# Altium project 底板.PrjPcb
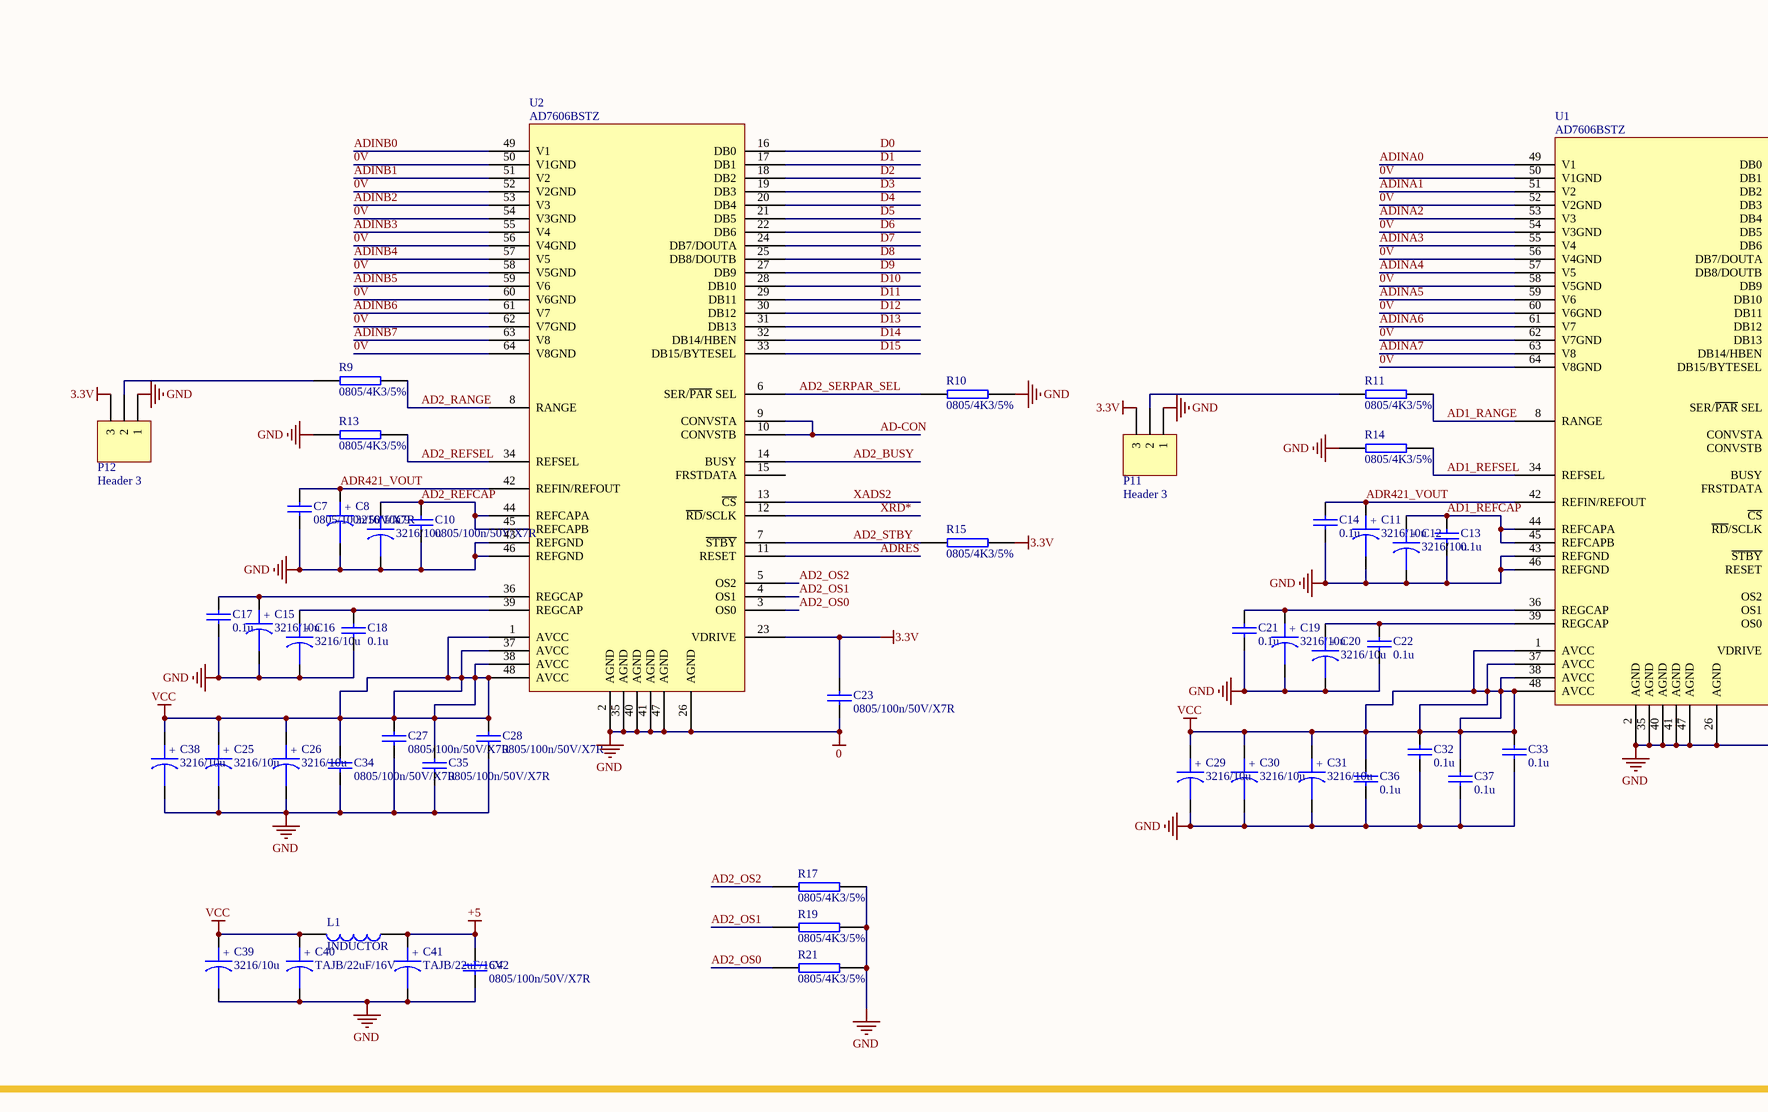
[diagram p0: 底板原理图.SchDoc, top left]
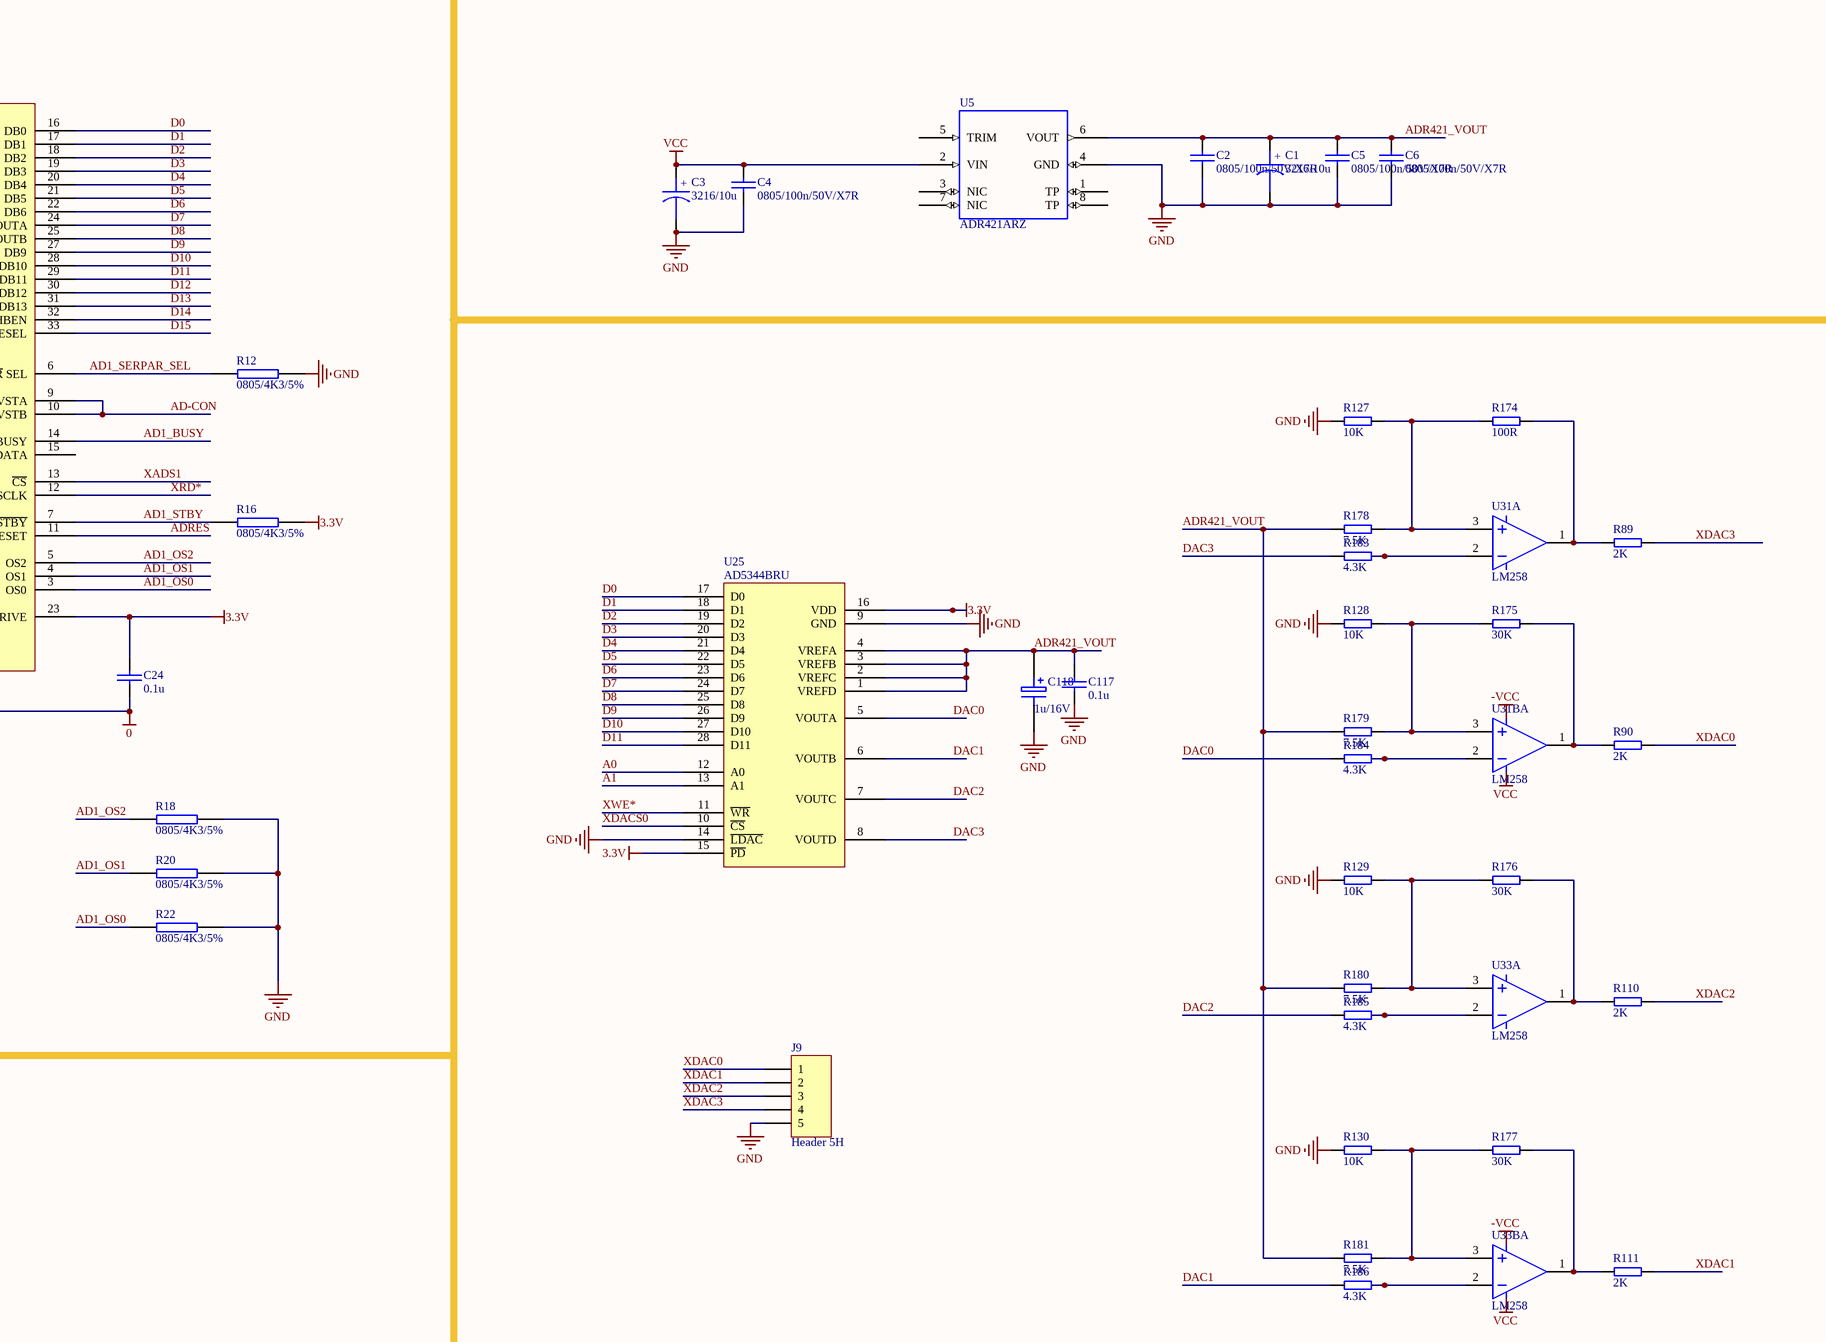
[diagram p1: 底板原理图.SchDoc, top middle]
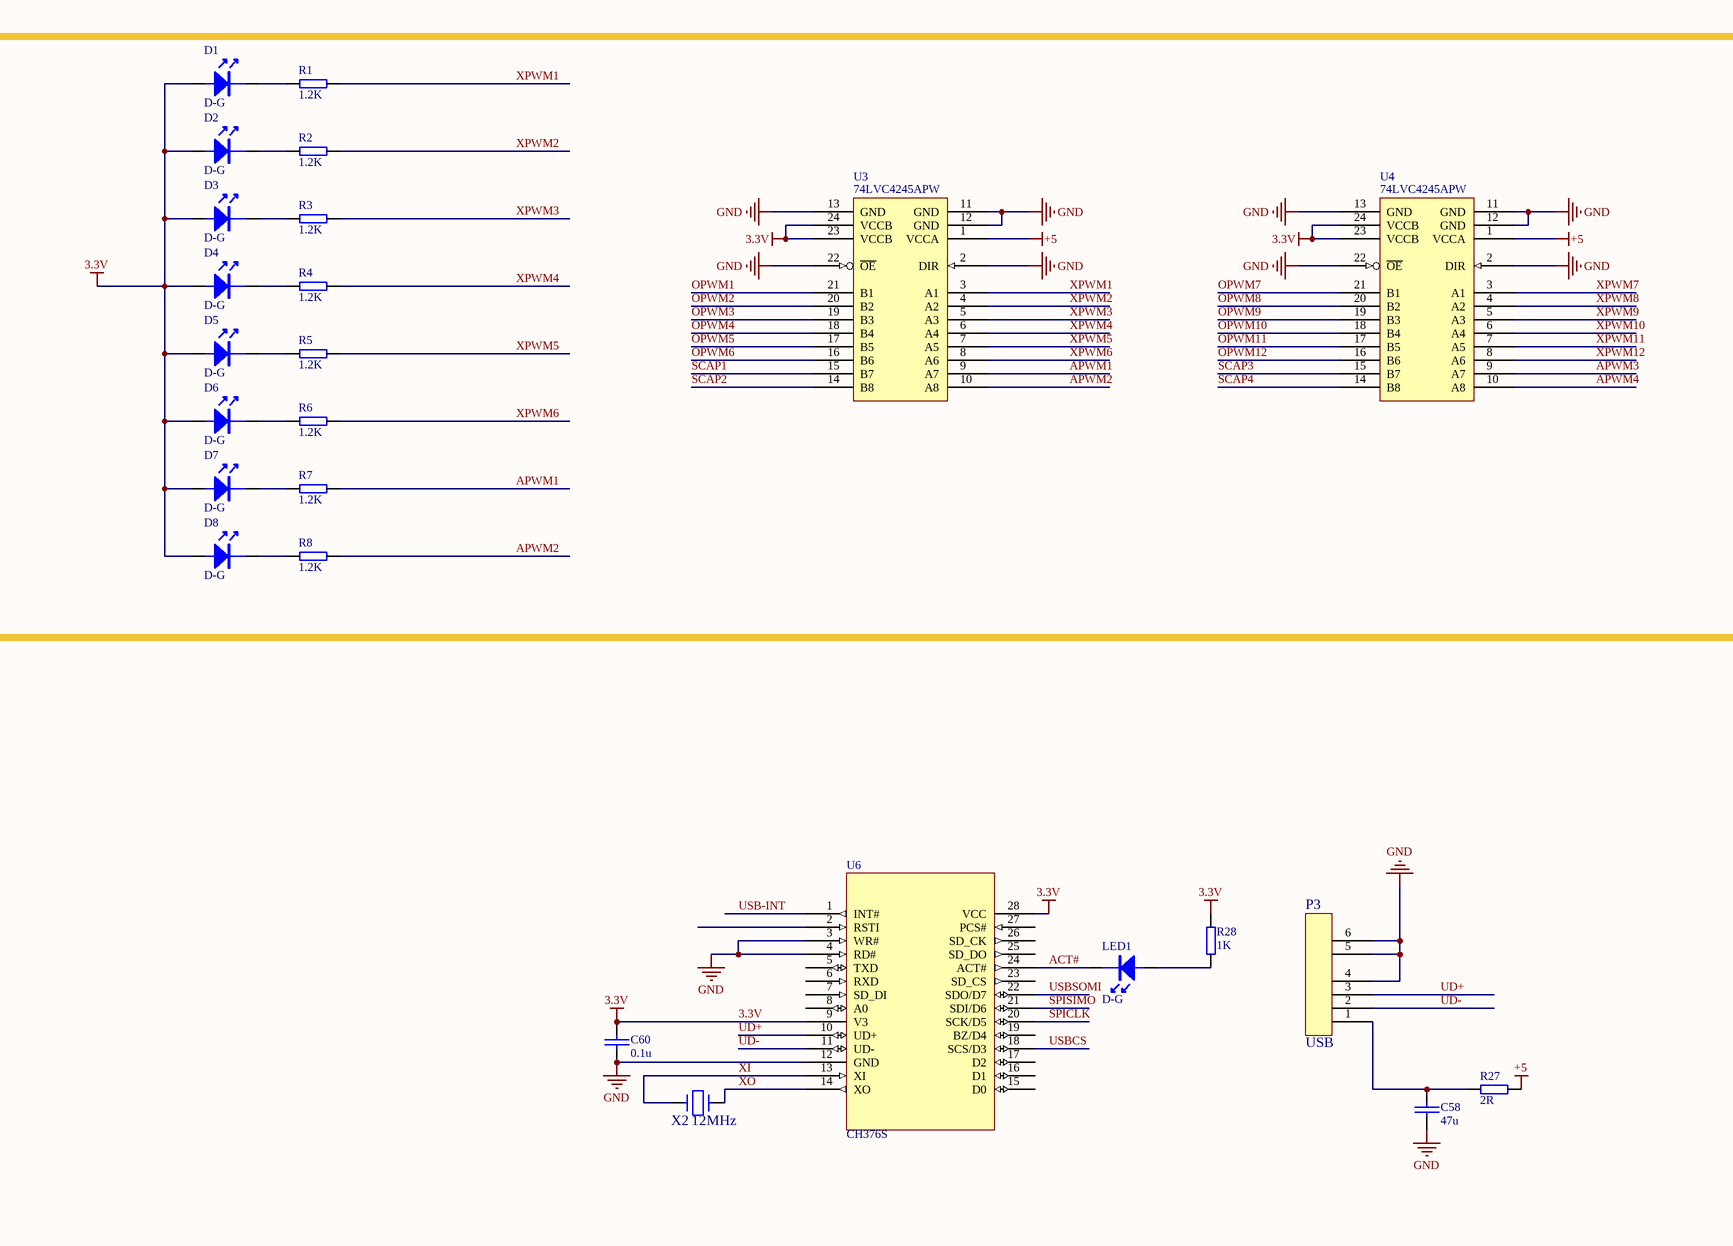
[diagram p2: 底板原理图.SchDoc, top right]
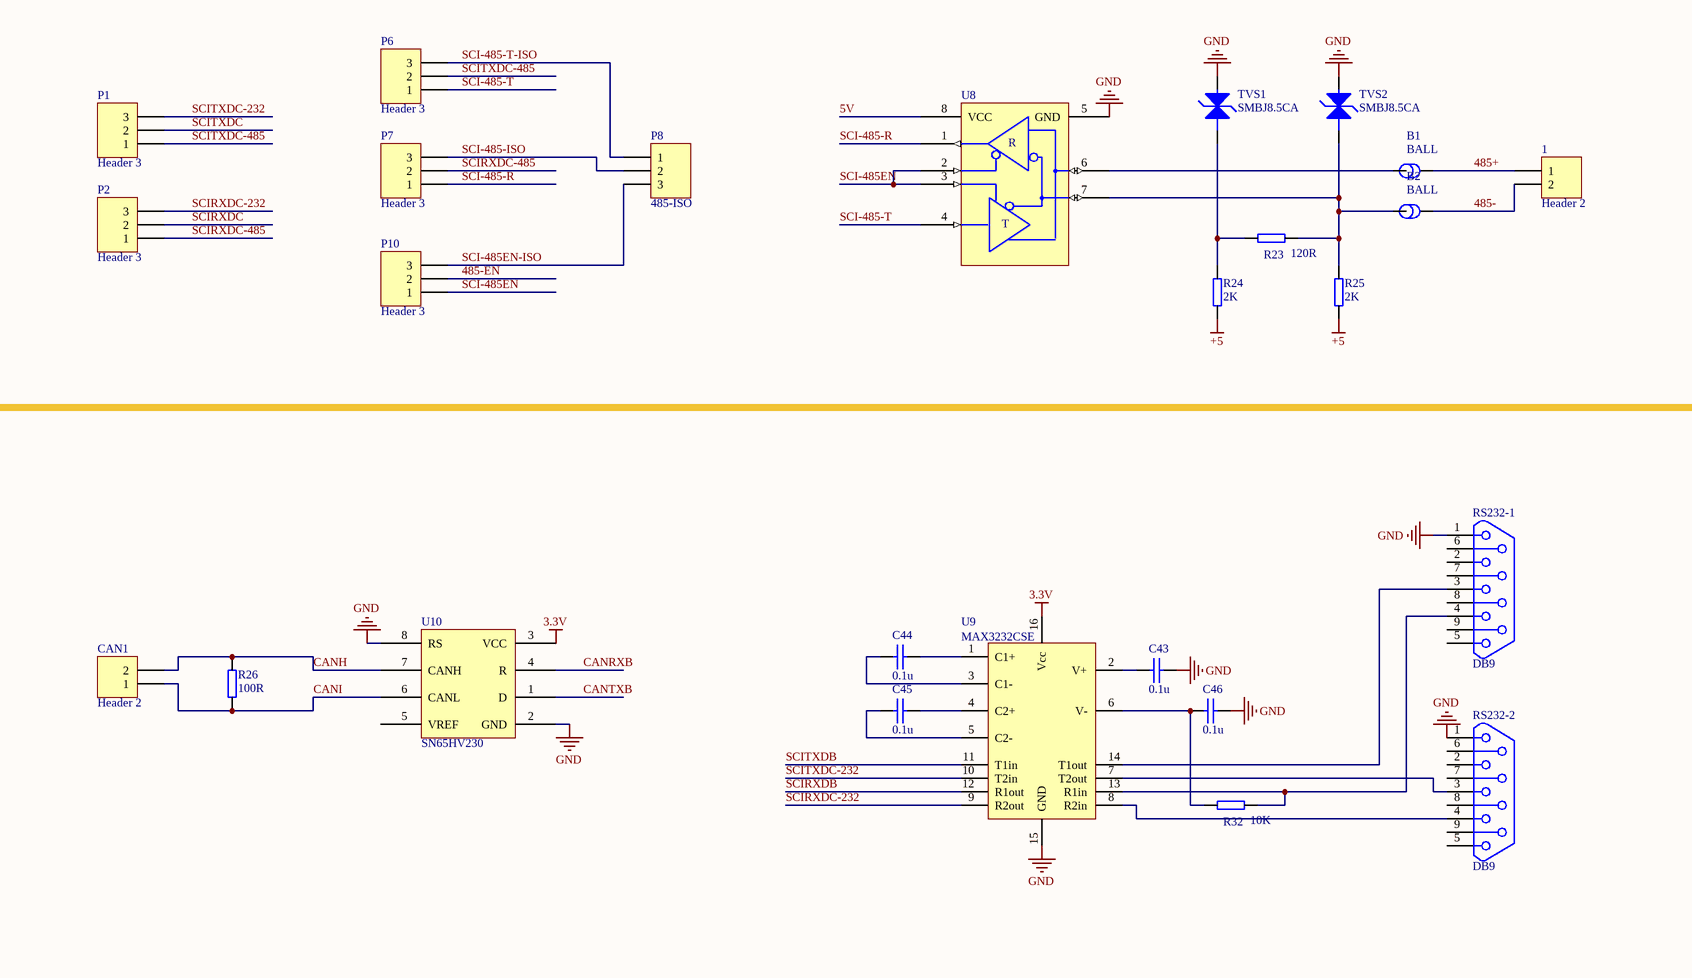
[diagram p3: 底板原理图.SchDoc, centre left]
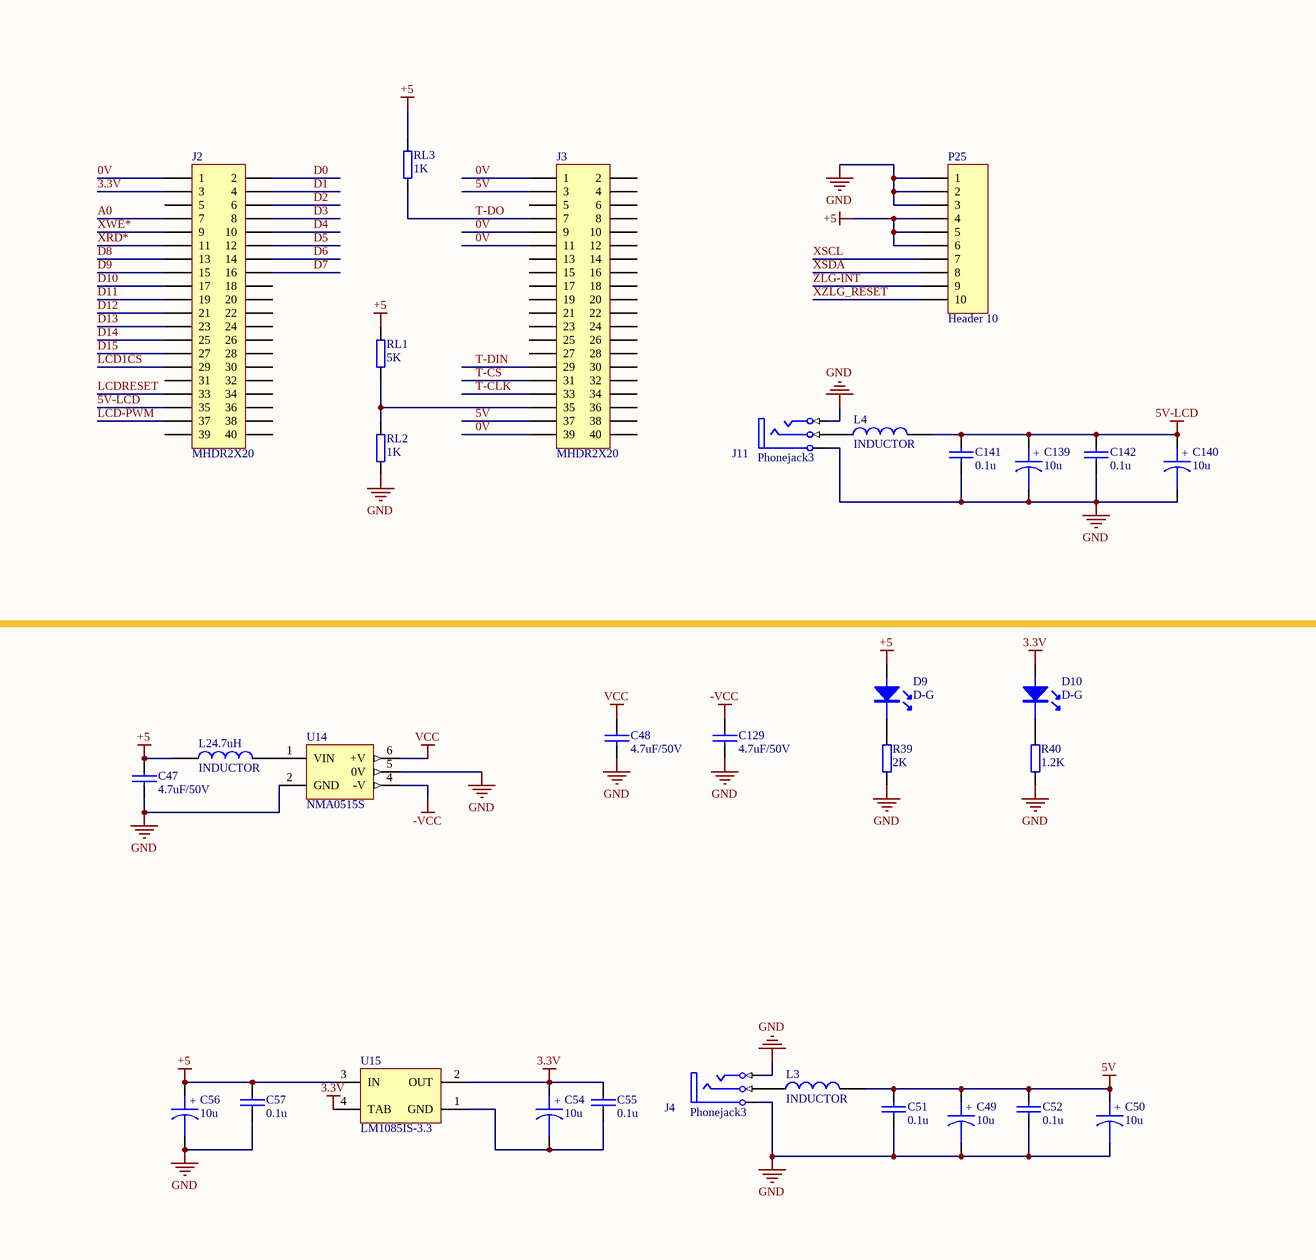
[diagram p4: 底板原理图.SchDoc, centre middle]
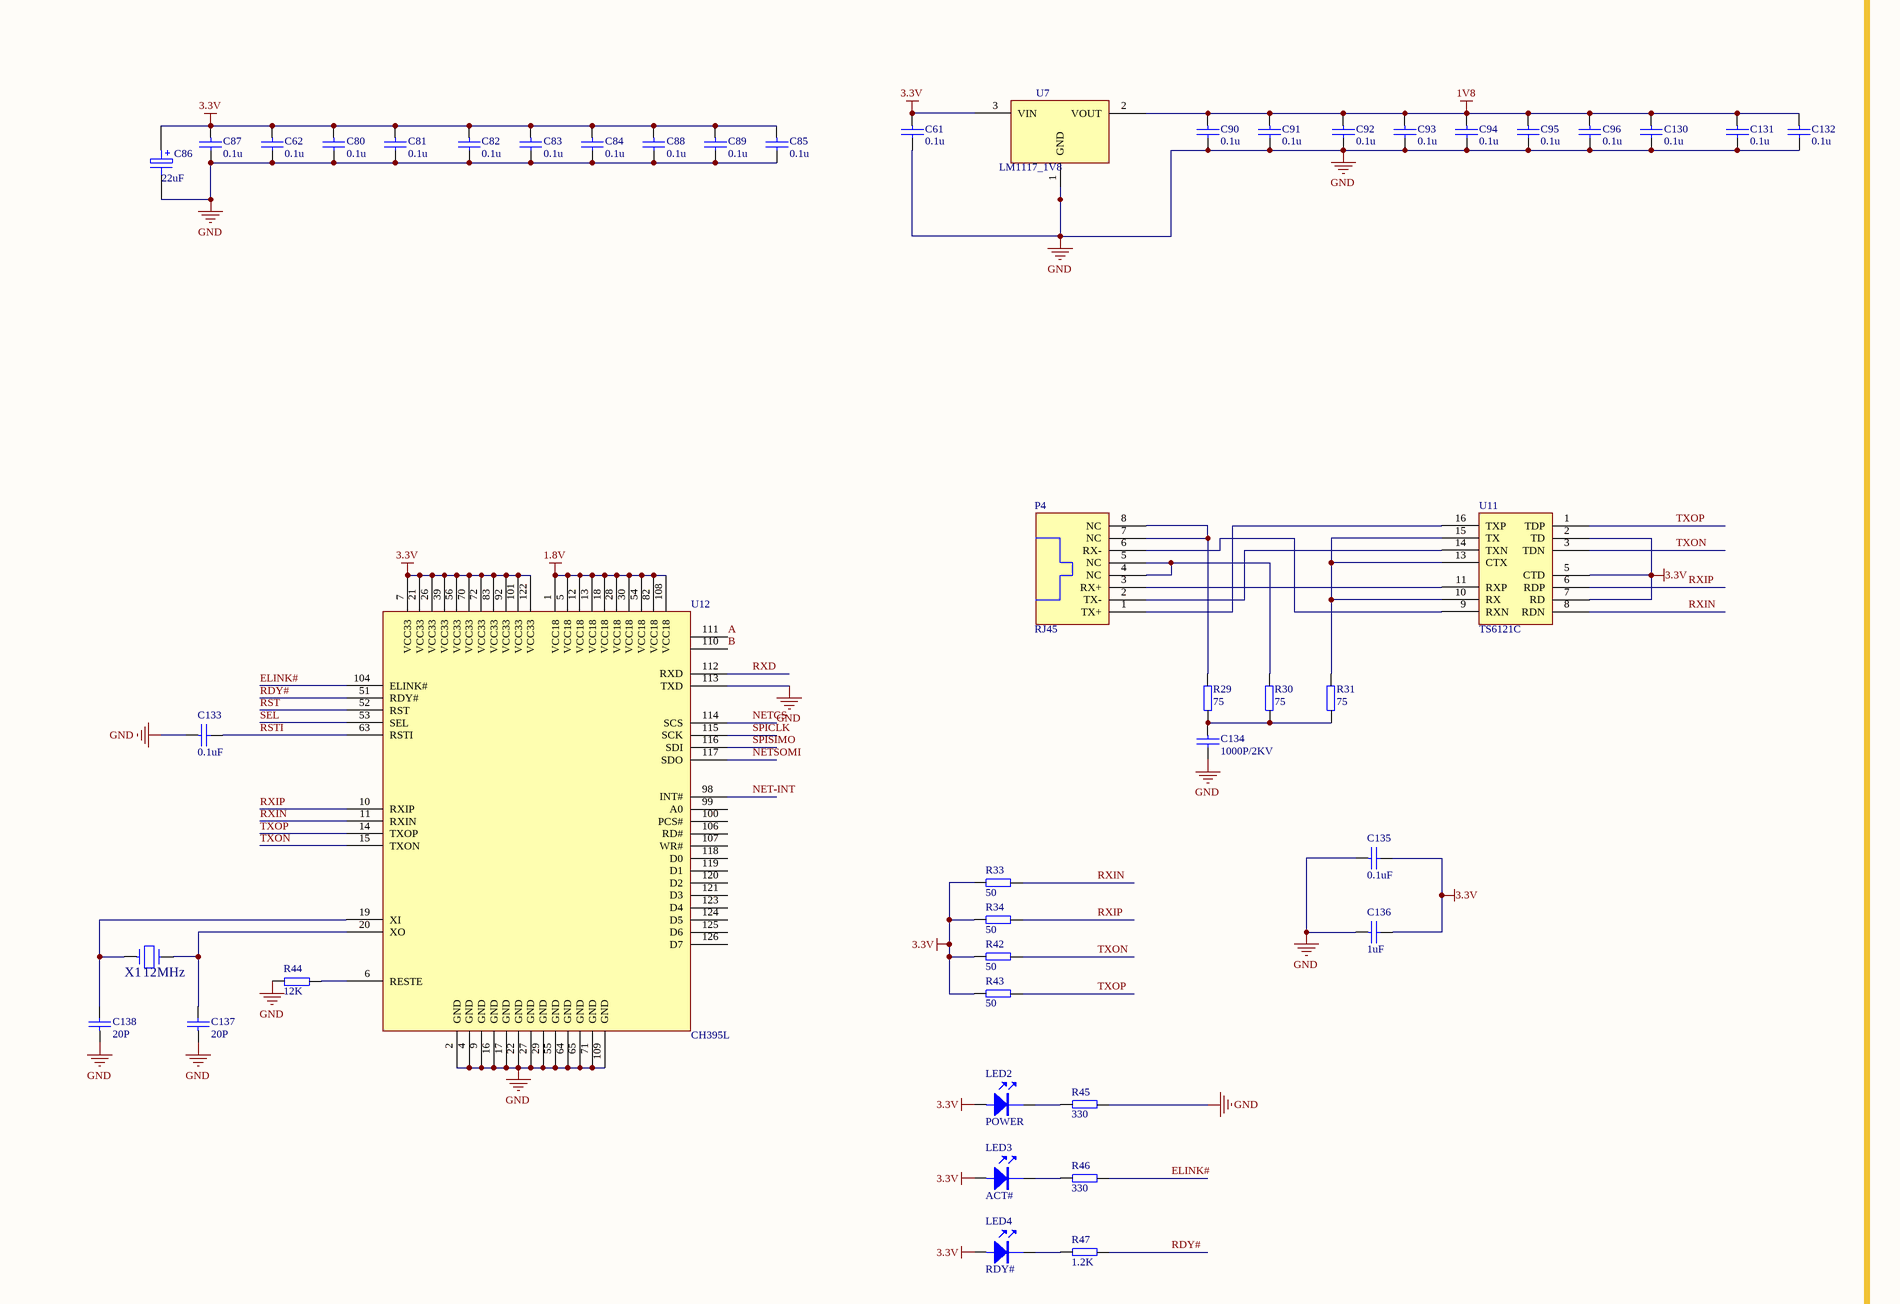
[diagram p5: 底板原理图.SchDoc, centre right]
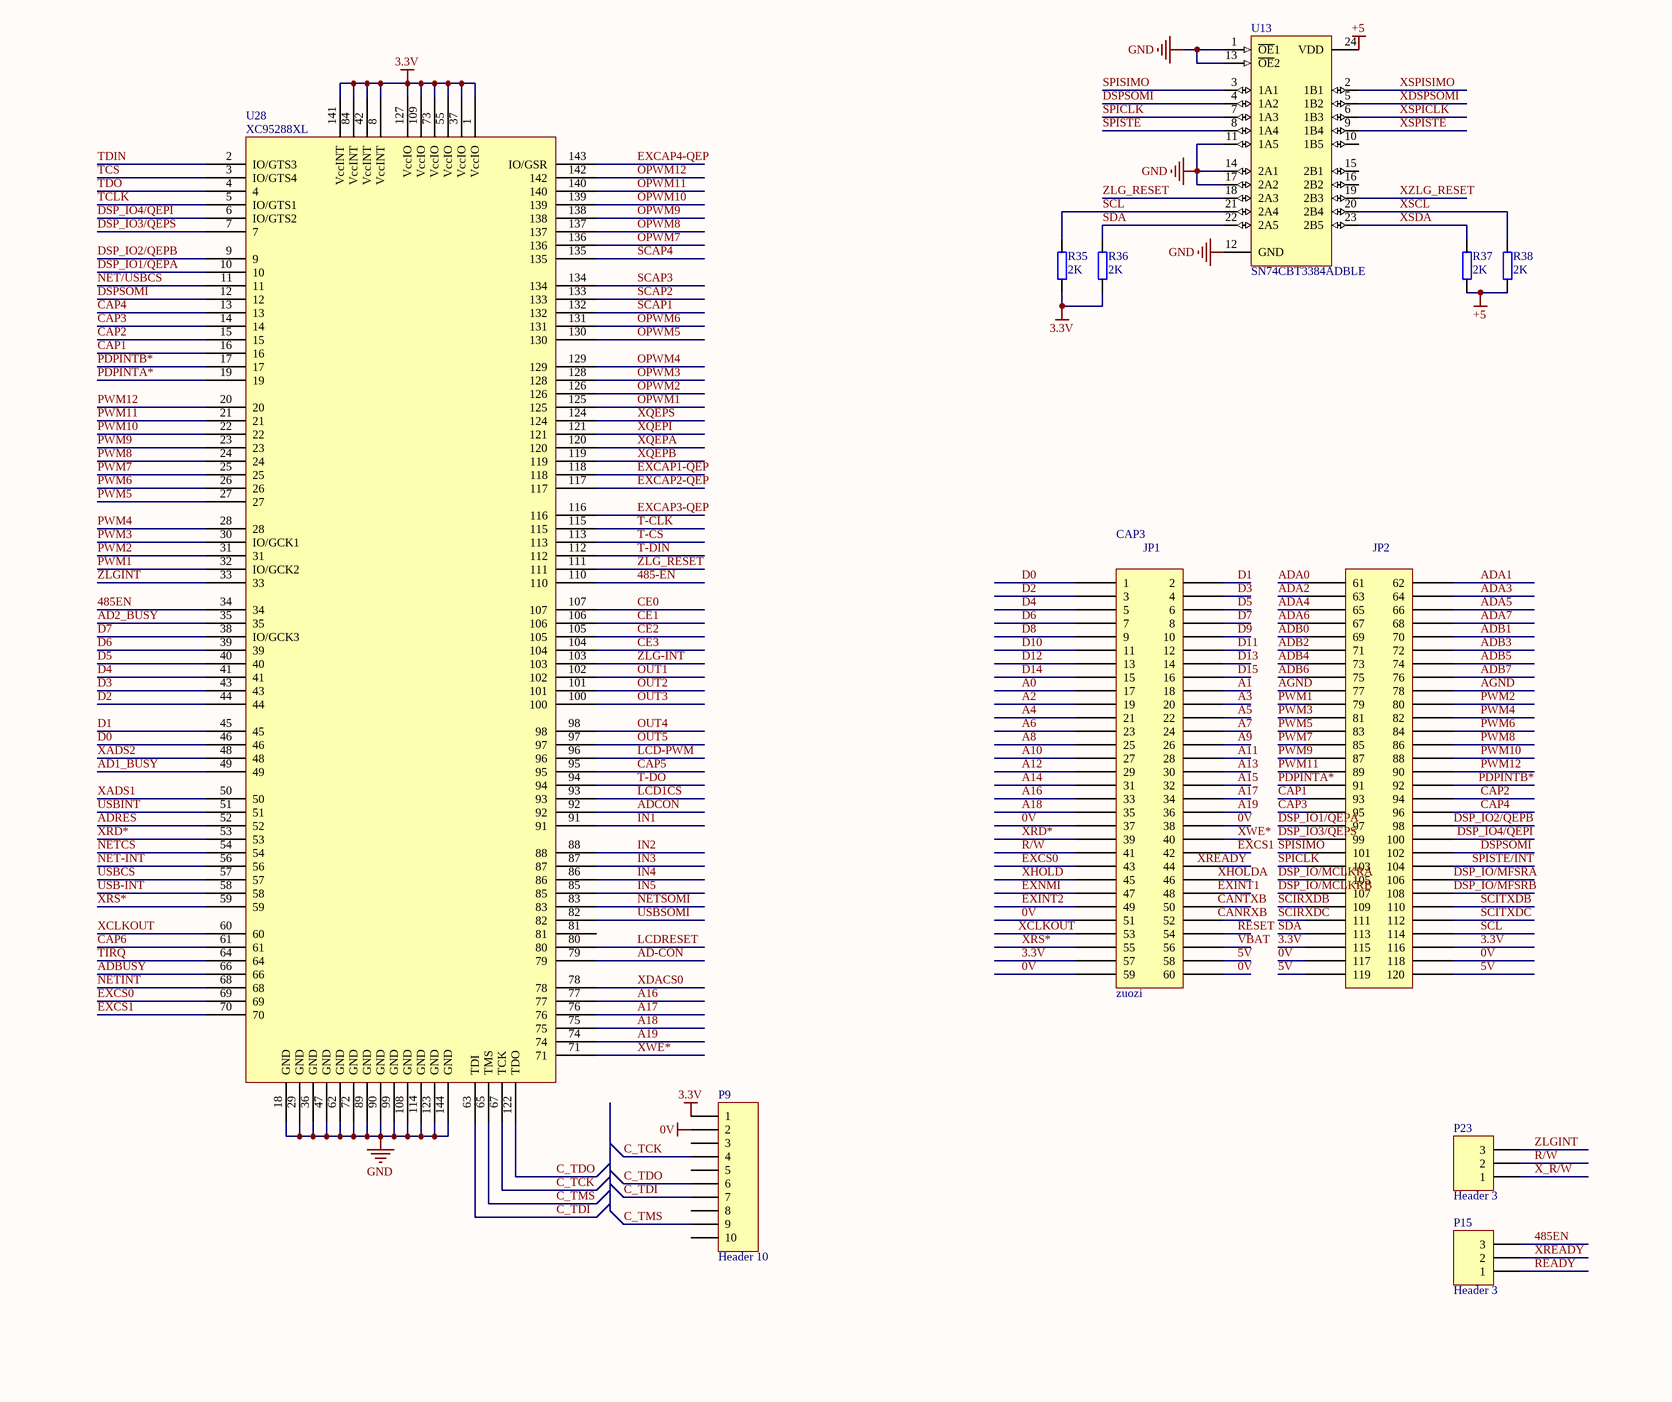
[diagram p6: 底板原理图.SchDoc, bottom left]
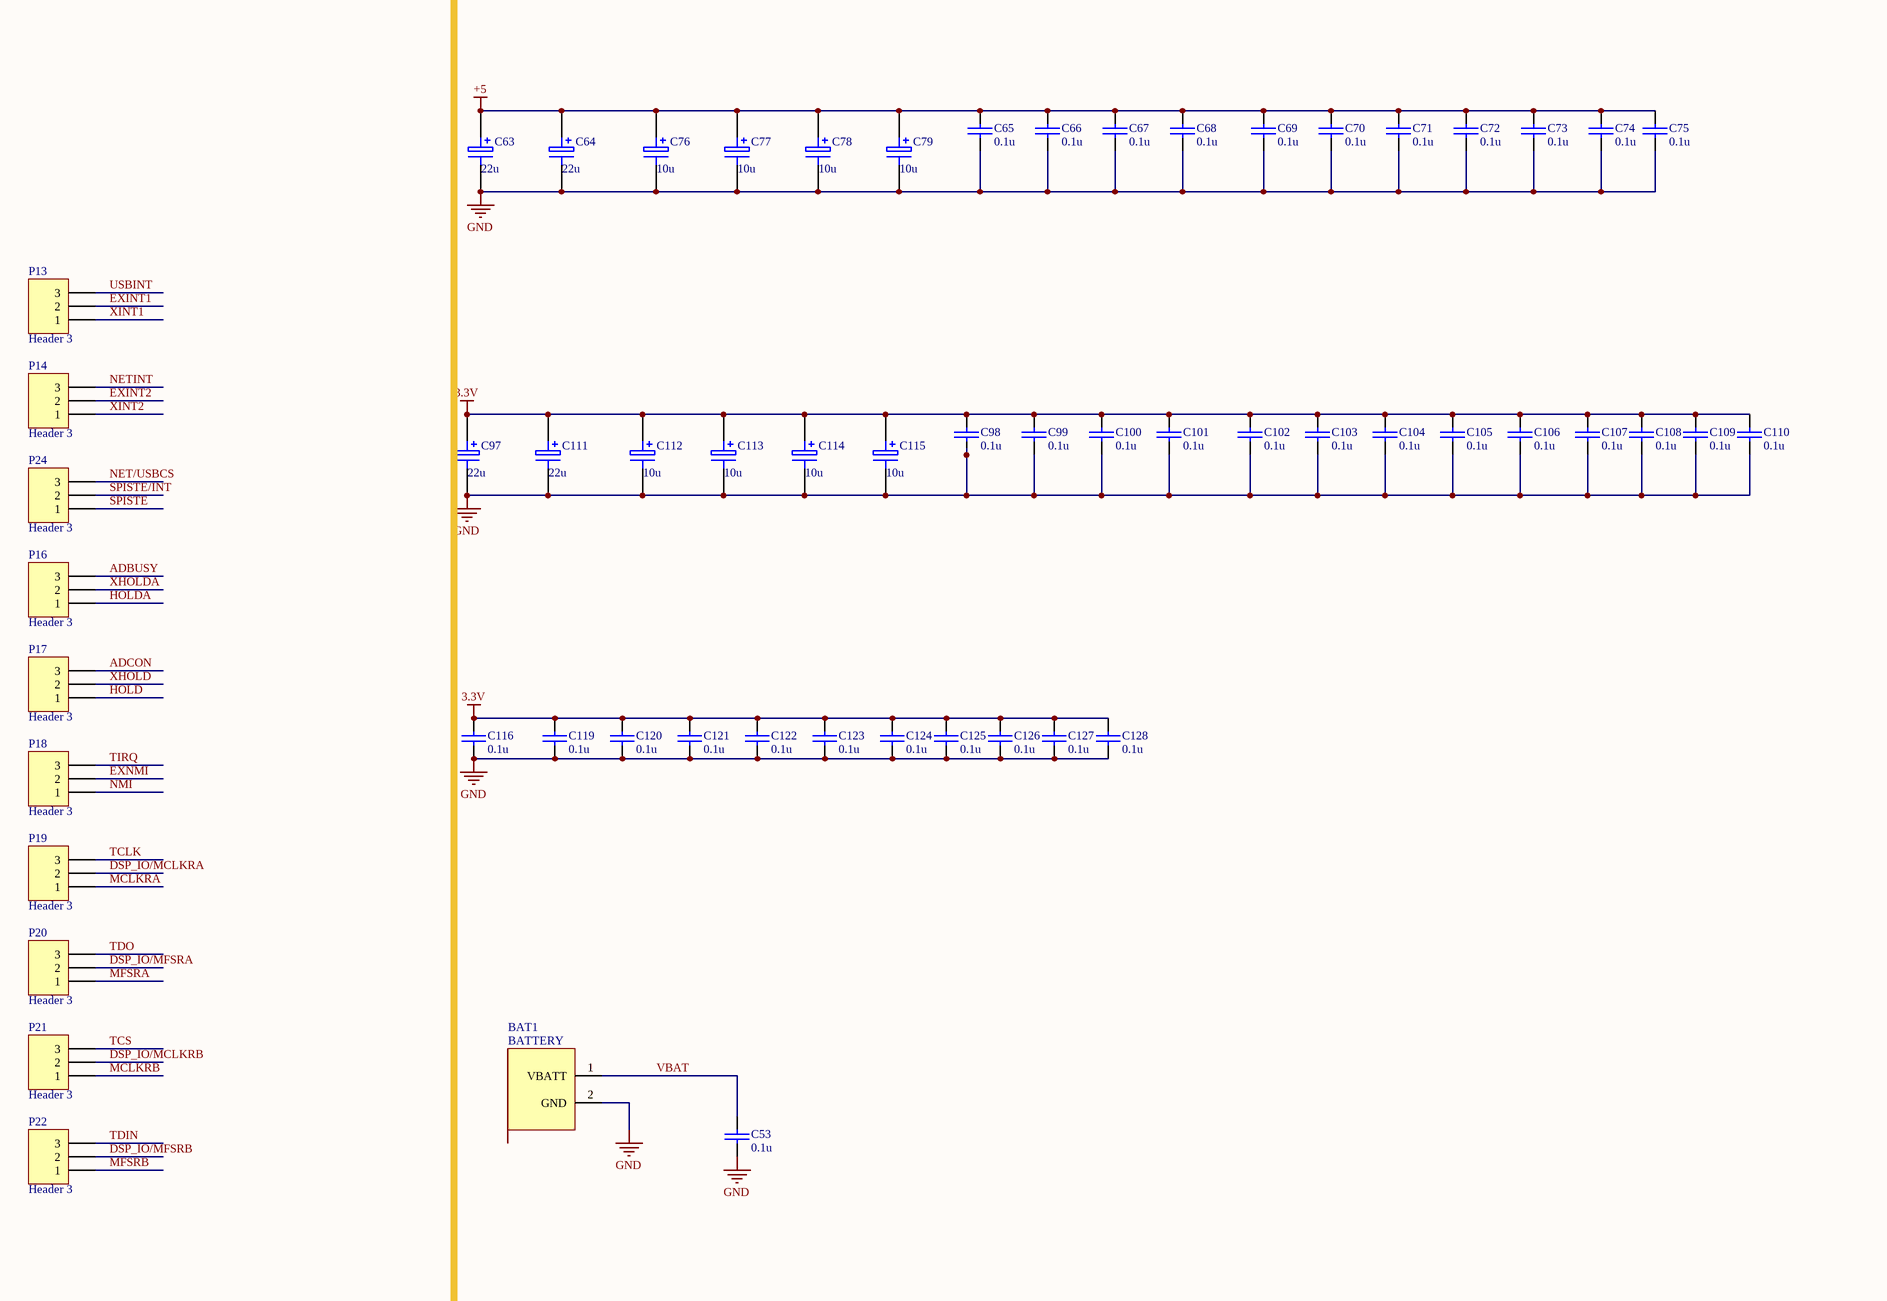
[diagram p7: 底板原理图.SchDoc, bottom middle]
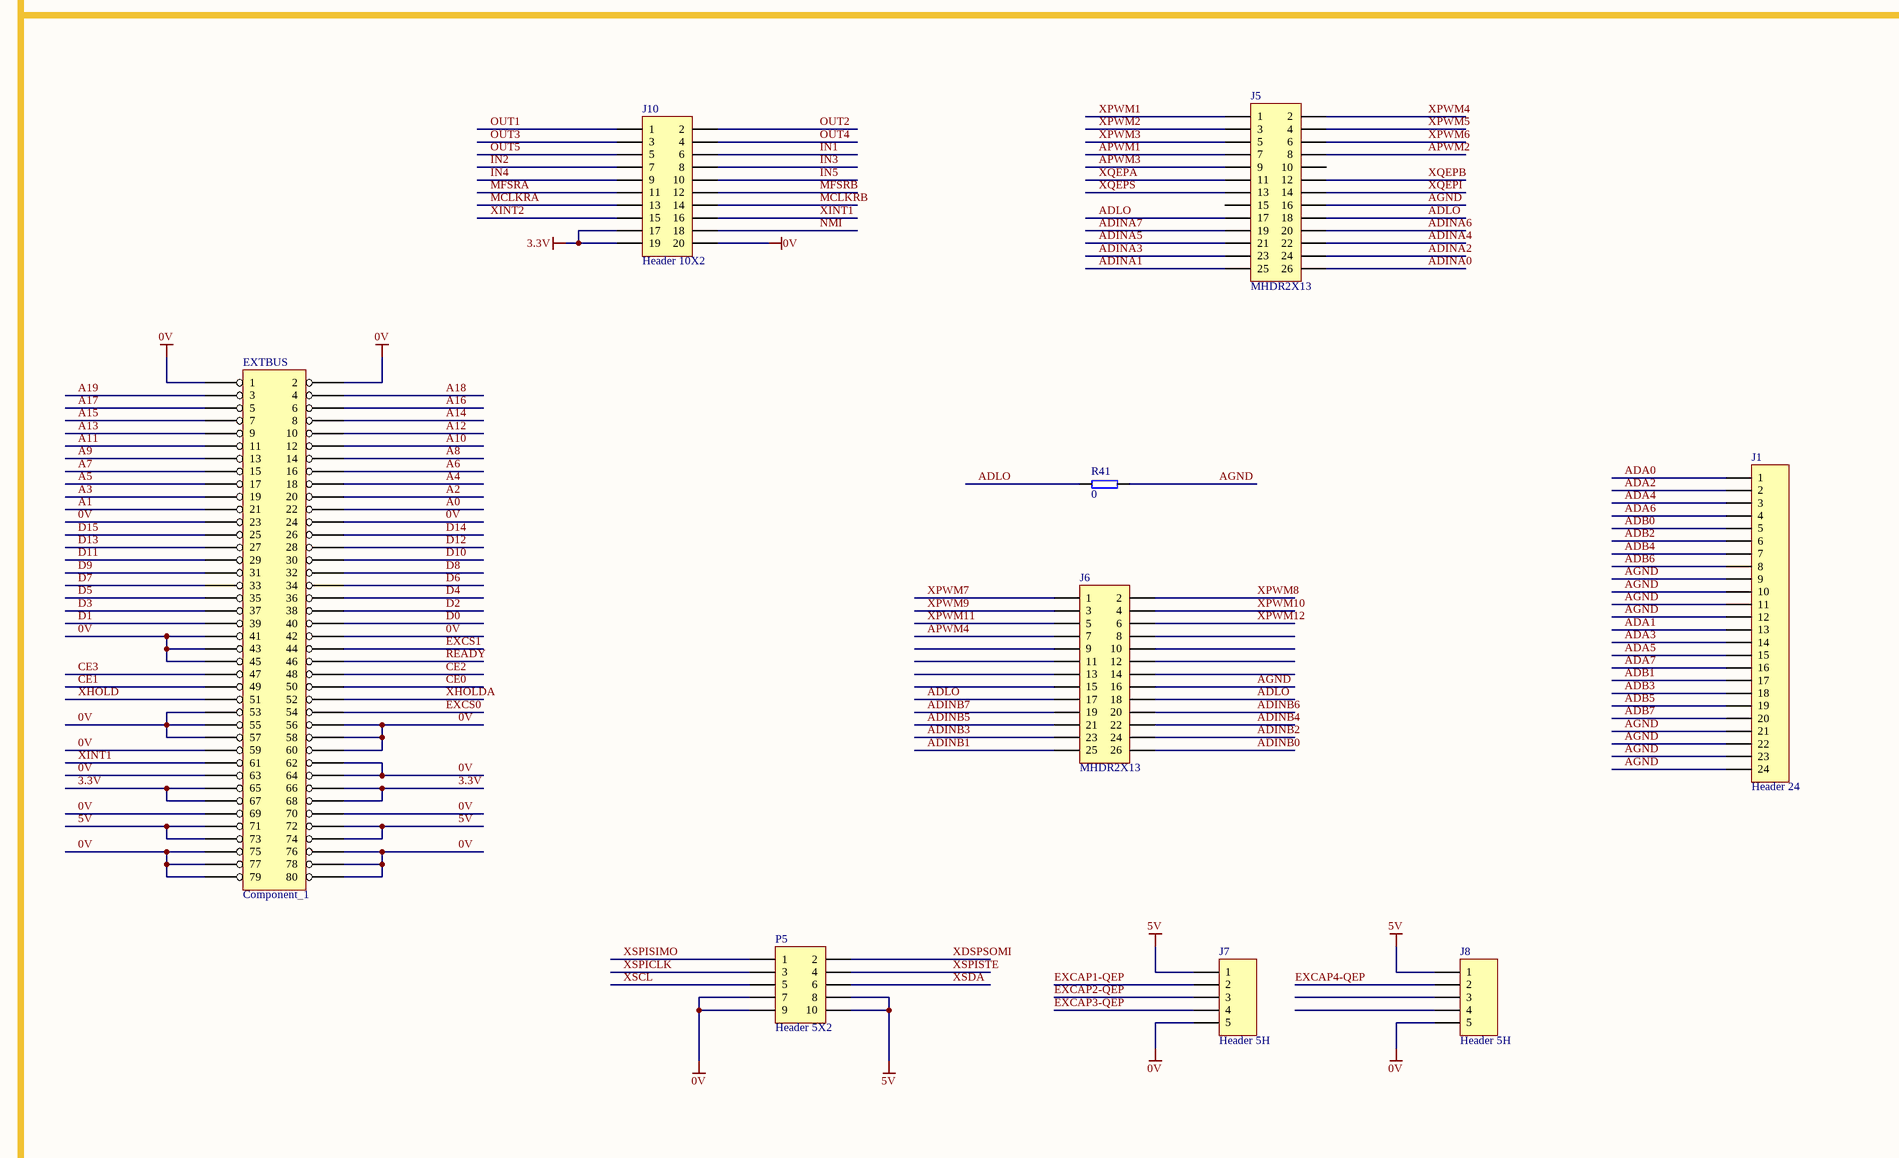
[diagram p8: 底板原理图.SchDoc, bottom right]
1 sheet, 299 parts. Net scope: global (net labels, ports and power ports of the same name join across sheets).
Board file: 底板PCB.PcbDoc

## Sheet 底板原理图.SchDoc
size A0

### Parts
1  Header 2  [HDR1X2]
B1  BALL  [0805-S]
B2  BALL  [0805-S]
BAT1  BATTERY  [BAT600]
C1  3216/10u  [3216]
C2  0805/100n/50V/X7R  [0805]
C3  3216/10u  [3216]
C4  0805/100n/50V/X7R  [0805]
C5  0805/100n/50V/X7R  [0805]
C6  0805/100n/50V/X7R  [0805]
C7  0805/100n/50V/X7R  [0805]
C8  3216/10u  [3216]
C9  3216/10u  [3216]
C10  0805/100n/50V/X7R  [0805]
C11  3216/10u  [3216]
C12  3216/10u  [3216]
C13  0.1u  [0805]
C14  0.1u  [0805]
C15  3216/10u  [3216]
C16  3216/10u  [3216]
C17  0.1u  [0805]
C18  0.1u  [0805]
C19  3216/10u  [3216]
C20  3216/10u  [3216]
C21  0.1u  [0805]
C22  0.1u  [0805]
C23  0805/100n/50V/X7R  [0805]
C24  0.1u  [0805]
C25  3216/10u  [3216]
C26  3216/10u  [3216]
C27  0805/100n/50V/X7R  [0805]
C28  0805/100n/50V/X7R  [0805]
C29  3216/10u  [3216]
C30  3216/10u  [3216]
C31  3216/10u  [3216]
C32  0.1u  [0805]
C33  0.1u  [0805]
C34  0805/100n/50V/X7R  [0805]
C35  0805/100n/50V/X7R  [0805]
C36  0.1u  [0805]
C37  0.1u  [0805]
C38  3216/10u  [3216]
C39  3216/10u  [3216]
C40  TAJB/22uF/16V  [3216]
C41  TAJB/22uF/16V  [3216]
C42  0805/100n/50V/X7R  [0805]
C43  0.1u  [0805]
C44  0.1u  [0805]
C45  0.1u  [0805]
C46  0.1u  [0805]
C47  4.7uF/50V  [0805]
C48  4.7uF/50V  [0805]
C49  10u  [3216]
C50  10u  [3216]
C51  0.1u  [0805]
C52  0.1u  [0805]
C53  0.1u  [0805]
C54  10u  [3216]
C55  0.1u  [0805]
C56  10u  [3216]
C57  0.1u  [0805]
C58  47u  [0805]
C60  0.1u  [0805]
C61  0.1u  [0805]
C62  0.1u  [0805]
C63  22u  [3528]
C64  22u  [3528]
C65  0.1u  [0805]
C66  0.1u  [0805]
C67  0.1u  [0805]
C68  0.1u  [0805]
C69  0.1u  [0805]
C70  0.1u  [0805]
C71  0.1u  [0805]
C72  0.1u  [0805]
C73  0.1u  [0805]
C74  0.1u  [0805]
C75  0.1u  [0805]
C76  10u  [3528]
C77  10u  [3528]
C78  10u  [3528]
C79  10u  [3528]
C80  0.1u  [0805]
C81  0.1u  [0805]
C82  0.1u  [0805]
C83  0.1u  [0805]
C84  0.1u  [0805]
C85  0.1u  [0805]
C86  22uF  [3528]
C87  0.1u  [0805]
C88  0.1u  [0805]
C89  0.1u  [0805]
C90  0.1u  [0805]
C91  0.1u  [0805]
C92  0.1u  [0805]
C93  0.1u  [0805]
C94  0.1u  [0805]
C95  0.1u  [0805]
C96  0.1u  [0805]
C97  22u  [3528]
C98  0.1u  [0805]
C99  0.1u  [0805]
C100  0.1u  [0805]
C101  0.1u  [0805]
C102  0.1u  [0805]
C103  0.1u  [0805]
C104  0.1u  [0805]
C105  0.1u  [0805]
C106  0.1u  [0805]
C107  0.1u  [0805]
C108  0.1u  [0805]
C109  0.1u  [0805]
C110  0.1u  [0805]
C111  22u  [3528]
C112  10u  [3528]
C113  10u  [3528]
C114  10u  [3528]
C115  10u  [3528]
C116  0.1u  [0805]
C117  0.1u  [0805]
C118  1u/16V  [3528]
C119  0.1u  [0805]
C120  0.1u  [0805]
C121  0.1u  [0805]
C122  0.1u  [0805]
C123  0.1u  [0805]
C124  0.1u  [0805]
C125  0.1u  [0805]
C126  0.1u  [0805]
C127  0.1u  [0805]
C128  0.1u  [0805]
C129  4.7uF/50V  [0805]
C130  0.1u  [0805]
C131  0.1u  [0805]
C132  0.1u  [0805]
C133  0.1uF  [0805]
C134  1000P/2KV  [0805]
C135  0.1uF  [0805]
C136  1uF  [0805]
C137  20P  [0805]
C138  20P  [0805]
C139  10u  [3216]
C140  10u  [3216]
C141  0.1u  [0805]
C142  0.1u  [0805]
CAN1  Header 2  [HDR1X2]
CAP3  zuozi  [zuozi]
D1  D-G  [LED0805-JW]
D2  D-G  [LED0805-JW]
D3  D-G  [LED0805-JW]
D4  D-G  [LED0805-JW]
D5  D-G  [LED0805-JW]
D6  D-G  [LED0805-JW]
D7  D-G  [LED0805-JW]
D8  D-G  [LED0805-JW]
D9  D-G  [LED0805-JW]
D10  D-G  [LED0805-JW]
EXTBUS  Component_1  [PLUG80]
J1  Header 24  [PLUG24]
J2  MHDR2X20  [MHDR2X20]
J3  MHDR2X20  [MHDR2X20]
J4  Phonejack3  [POWER_PLUG]
J5  MHDR2X13  [IDC26]
J6  MHDR2X13  [IDC26]
J7  Header 5H  [SIP5]
J8  Header 5H  [SIP5]
J9  Header 5H  [SIP5]
J10  Header 10X2  [HDR210]
J11  Phonejack3  [POWER_PLUG]
L1  INDUCTOR  [1206]
L3  INDUCTOR  [1206]
L4  INDUCTOR  [1206]
L24.7uH  INDUCTOR  [1206]
LED1  D-G  [LED0805-JW]
LED2  POWER  [LED0805-JW]
LED3  ACT#  [LED0805-JW]
LED4  RDY#  [LED0805-JW]
P1  Header 3  [HDR1X3]
P2  Header 3  [HDR1X3]
P3  USB  [USBA]
P4  RJ45  [RJ45]
P5  Header 5X2  [DIP10-2mm]
P6  Header 3  [HDR1X3]
P7  Header 3  [HDR1X3]
P8  485-ISO  [HDR1X3]
P9  Header 10  [HDR110]
P10  Header 3  [HDR1X3]
P11  Header 3  [HDR1X3]
P12  Header 3  [HDR1X3]
P13  Header 3  [HDR1X3]
P14  Header 3  [HDR1X3]
P15  Header 3  [HDR1X3]
P16  Header 3  [HDR1X3]
P17  Header 3  [HDR1X3]
P18  Header 3  [HDR1X3]
P19  Header 3  [HDR1X3]
P20  Header 3  [HDR1X3]
P21  Header 3  [HDR1X3]
P22  Header 3  [HDR1X3]
P23  Header 3  [HDR1X3]
P24  Header 3  [HDR1X3]
P25  Header 10  [HDR110]
R1  1.2K  [0805]
R2  1.2K  [0805]
R3  1.2K  [0805]
R4  1.2K  [0805]
R5  1.2K  [0805]
R6  1.2K  [0805]
R7  1.2K  [0805]
R8  1.2K  [0805]
R9  0805/4K3/5%  [0805]
R10  0805/4K3/5%  [0805]
R11  0805/4K3/5%  [0805]
R12  0805/4K3/5%  [0805]
R13  0805/4K3/5%  [0805]
R14  0805/4K3/5%  [0805]
R15  0805/4K3/5%  [0805]
R16  0805/4K3/5%  [0805]
R17  0805/4K3/5%  [0805]
R18  0805/4K3/5%  [0805]
R19  0805/4K3/5%  [0805]
R20  0805/4K3/5%  [0805]
R21  0805/4K3/5%  [0805]
R22  0805/4K3/5%  [0805]
R23  120R  [0805]
R24  2K  [0805]
R25  2K  [0805]
R26  100R  [0805]
R27  2R  [0805]
R28  1K  [0805]
R29  75  [0805]
R30  75  [0805]
R31  75  [0805]
R32  10K  [0805]
R33  50  [0805]
R34  50  [0805]
R35  2K  [0805]
R36  2K  [0805]
R37  2K  [0805]
R38  2K  [0805]
R39  2K  [0805]
R40  1.2K  [0805]
R41  0  [0805]
R42  50  [0805]
R43  50  [0805]
R44  12K  [0805]
R45  330  [0805]
R46  330  [0805]
R47  1.2K  [0805]
R89  2K  [0805]
R90  2K  [0805]
R110  2K  [0805]
R111  2K  [0805]
R127  10K  [0805]
R128  10K  [0805]
R129  10K  [0805]
R130  10K  [0805]
R174  100R  [0805]
R175  30K  [0805]
R176  30K  [0805]
R177  30K  [0805]
R178  7.5K  [0805]
R179  7.5K  [0805]
R180  7.5K  [0805]
R181  7.5K  [0805]
R183  4.3K  [0805]
R184  4.3K  [0805]
R185  4.3K  [0805]
R186  4.3K  [0805]
RL1  5K  [0805]
RL2  1K  [0805]
RL3  1K  [0805]
RS232-1  DB9  [DB-9RA/M]
RS232-2  DB9  [DB-9RA/M]
TVS1  SMBJ8.5CA  [7227]
TVS2  SMBJ8.5CA  [7227]
U1  AD7606BSTZ  [TQFP64]
U2  AD7606BSTZ  [TQFP64]
U3  74LVC4245APW  [TSOP-24]
U4  74LVC4245APW  [TSOP-24]
U5  ADR421ARZ  [SO-8]
U6  CH376S  [SOP28]
U7  LM1117_1V8  [SOT-223]
U8  MAX485  [so-8]  (value not drawn)
U9  MAX3232CSE  [SO-16]
U10  SN65HV230  [SO-8]
U11  TS6121C  [HR601680]
U12  CH395L  [LQFP128]
U13  SN74CBT3384ADBLE  [3384]
U14  NMA0515S  [MIP-6]
U15  LM1085IS-3.3  [TS3B_N]
U25  AD5344BRU  [TSOP-28]
U28  XC95288XL  [QFP144]
U31  LM258  [SO-8]  (part A of 2)
U31B  LM258  [SO-8]  (part A of 2)
U33  LM258  [SO-8]  (part A of 2)
U33B  LM258  [SO-8]  (part A of 2)
X1  12MHz  [XTAL40/24]
X2  12MHz  [XTAL40/24]

### Nets
0: BAT1.2(GND) C1.2 C2.2 C3.2 C4.2 C5.2 C6.2 C7.2 C8.2 C9.2 C10.2 C11.2 C12.2 C13.2 C14.2 C15.2 C16.2 C17.2 C18.2 C19.2 C20.2 C21.2 C22.2 C23.2 C24.2 C25.2 C26.2 C27.2 C28.2 C29.2 C30.2 C31.2 C32.2 C33.2 C34.2 C35.2 C36.2 C37.2 C38.2 C39.2 C40.2 C41.2 C42.2 C43.2 C46.2 C47.2 C48.2 C49.2 C50.2 C51.2 C52.2 C53.2 C56.2 C57.2 C58.2 C60.2 C61.2 C62.2 C63.2 C64.2 C65.2 C66.2 C67.2 C68.2 C69.2 C70.2 C71.2 C72.2 C73.2 C74.2 C75.2 C76.2 C77.2 C78.2 C79.2 C80.2 C81.2 C82.2 C83.2 C84.2 C85.2 C86.2 C87.2 C88.2 C89.2 C90.2 C91.2 C92.2 C93.2 C94.2 C95.2 C96.2 C97.2 C98.2 C99.2 C100.2 C101.2 C102.2 C103.2 C104.2 C105.2 C106.2 C107.2 C108.2 C109.2 C110.2 C111.2 C112.2 C113.2 C114.2 C115.2 C116.2 C117.2 C118.2 C119.2 C120.2 C121.2 C122.2 C123.2 C124.2 C125.2 C126.2 C127.2 C128.2 C129.2 C130.2 C131.2 C132.2 C133.1 C134.2 C135.1 C136.1 C137.1 C138.1 C139.2 C140.2 C141.2 C142.2 J4.1(T) J4.3(S) J9.5 J11.1(T) J11.3(S) P3.4 P3.5 P3.6 P11.1 P12.1 P25.1 P25.2 P25.3 R10.1 R12.1 R13.1 R14.1 R17.1 R18.1 R19.1 R20.1 R21.1 R22.1 R39.2 R40.2 R44.1 R45.1 R127.2 R128.2 R129.2 R130.2 RL2.2 RS232-1.1 RS232-2.1 TVS1.2 TVS2.2 U1.2(AGND) U1.26(AGND) U1.35(AGND) U1.40(AGND) U1.41(AGND) U1.43(REFGND) U1.46(REFGND) U1.47(AGND) U2.2(AGND) U2.26(AGND) U2.35(AGND) U2.40(AGND) U2.41(AGND) U2.43(REFGND) U2.46(REFGND) U2.47(AGND) U3.2(DIR) U3.11(GND) U3.12(GND) U3.13(GND) U3.22(~{OE}) U4.2(DIR) U4.11(GND) U4.12(GND) U4.13(GND) U4.22(~{OE}) U5.4(GND) U6.3(WR#) U6.4(RD#) U6.12(GND) U7.1(GND) U8.5(GND) U9.15(GND) U10.2(GND) U10.8(RS) U12.2(GND) U12.4(GND) U12.9(GND) U12.16(GND) U12.17(GND) U12.22(GND) U12.27(GND) U12.29(GND) U12.55(GND) U12.64(GND) U12.65(GND) U12.71(GND) U12.109(GND) U12.113(TXD) U13.1(~{OE}1) U13.11(1A5) U13.12(GND) U13.13(~{OE}2) U13.14(2A1) U13.17(2A2) U14.2(GND) U14.5(0V) U25.9(GND) U25.14(~{LDAC}) U28.18(GND) U28.29(GND) U28.36(GND) U28.47(GND) U28.62(GND) U28.72(GND) U28.89(GND) U28.90(GND) U28.99(GND) U28.108(GND) U28.114(GND) U28.123(GND) U28.144(GND)  [also labelled GND]
0V: CAP3.37 CAP3.38 CAP3.51 CAP3.59 CAP3.60 CAP3.117 CAP3.118 EXTBUS.1 EXTBUS.2 EXTBUS.23 EXTBUS.24 EXTBUS.41 EXTBUS.42 EXTBUS.43 EXTBUS.45 EXTBUS.53 EXTBUS.55 EXTBUS.56 EXTBUS.57 EXTBUS.58 EXTBUS.59 EXTBUS.60 EXTBUS.62 EXTBUS.63 EXTBUS.64 EXTBUS.69 EXTBUS.70 EXTBUS.75 EXTBUS.76 EXTBUS.77 EXTBUS.78 EXTBUS.79 EXTBUS.80 J2.1 J3.1 J3.9 J3.11 J3.39 J7.5 J8.5 J10.20 P5.7 P5.9 P9.2 U1.50(V1GND) U1.52(V2GND) U1.54(V3GND) U1.56(V4GND) U1.58(V5GND) U1.60(V6GND) U1.62(V7GND) U1.64(V8GND) U2.50(V1GND) U2.52(V2GND) U2.54(V3GND) U2.56(V4GND) U2.58(V5GND) U2.60(V6GND) U2.62(V7GND) U2.64(V8GND)
1.8V: U12.1(VCC18) U12.5(VCC18) U12.12(VCC18) U12.13(VCC18) U12.18(VCC18) U12.28(VCC18) U12.30(VCC18) U12.54(VCC18) U12.82(VCC18) U12.108(VCC18)
1V8: C90.1 C91.1 C92.1 C93.1 C94.1 C95.1 C96.1 C130.1 C131.1 C132.1 U7.2(VOUT)
3.3V: C23.1 C24.1 C54.1 C55.1 C60.1 C61.1 C62.1 C80.1 C81.1 C82.1 C83.1 C84.1 C85.1 C86.1 C87.1 C88.1 C89.1 C97.1 C98.1 C99.1 C100.1 C101.1 C102.1 C103.1 C104.1 C105.1 C106.1 C107.1 C108.1 C109.1 C110.1 C111.1 C112.1 C113.1 C114.1 C115.1 C116.1 C119.1 C120.1 C121.1 C122.1 C123.1 C124.1 C125.1 C126.1 C127.1 C128.1 C135.2 C136.2 CAP3.57 CAP3.115 CAP3.116 D1.1 D2.1 D3.1 D4.1 D5.1 D6.1 D7.1 D8.1 D10.1 EXTBUS.65 EXTBUS.66 EXTBUS.67 EXTBUS.68 J2.3 J10.17 J10.19 LED2.1 LED3.1 LED4.1 P9.1 P11.3 P12.3 R15.1 R16.1 R28.1 R33.2 R34.2 R35.1 R36.1 R42.2 R43.2 U1.23(VDRIVE) U2.23(VDRIVE) U3.23(VCCB) U3.24(VCCB) U4.23(VCCB) U4.24(VCCB) U6.9(V3) U6.28(VCC) U7.3(VIN) U9.16(Vcc) U10.3(VCC) U11.2(TD) U11.5(CTD) U11.7(RD) U12.7(VCC33) U12.21(VCC33) U12.26(VCC33) U12.39(VCC33) U12.56(VCC33) U12.70(VCC33) U12.72(VCC33) U12.83(VCC33) U12.92(VCC33) U12.101(VCC33) U12.122(VCC33) U15.2(OUT) U15.4(TAB) U25.15(~{PD}) U25.16(VDD) U28.1(VccIO) U28.8(VccINT) U28.37(VccIO) U28.42(VccINT) U28.55(VccIO) U28.73(VccIO) U28.84(VccINT) U28.109(VccIO) U28.127(VccIO) U28.141(VccINT)
5V: C49.1 C50.1 C51.1 C52.1 CAP3.58 CAP3.119 CAP3.120 EXTBUS.71 EXTBUS.72 EXTBUS.73 EXTBUS.74 J3.3 J3.37 J7.1 J8.1 L3.2 P5.8 P5.10 U8.8(VCC)
5V-LCD: C139.1 C140.1 C141.1 C142.1 J2.35 L4.2
+5: C41.1 C42.1 C47.1 C56.1 C57.1 C63.1 C64.1 C65.1 C66.1 C67.1 C68.1 C69.1 C70.1 C71.1 C72.1 C73.1 C74.1 C75.1 C76.1 C77.1 C78.1 C79.1 D9.1 L1.1 L24.7uH.1 P25.4 P25.5 P25.6 R24.1 R25.1 R27.2 R37.1 R38.1 RL1.1 RL3.1 U3.1(VCCA) U4.1(VCCA) U13.24(VDD) U15.3(IN)
-VCC: C129.1 U14.4(-V)
VCC: C3.1 C4.1 C25.1 C26.1 C27.1 C28.1 C29.1 C30.1 C31.1 C32.1 C33.1 C34.1 C35.1 C36.1 C37.1 C38.1 C39.1 C40.1 C48.1 L1.2 U1.1(AVCC) U1.37(AVCC) U1.38(AVCC) U1.48(AVCC) U2.1(AVCC) U2.37(AVCC) U2.38(AVCC) U2.48(AVCC) U5.2(VIN) U14.6(+V)
485+: 1.1 B1.2
485-: 1.2 B2.2
485-EN: P10.2 U28.110
485EN: P15.3 U28.34
A: U12.111
A0: CAP3.17 EXTBUS.22 J2.7 U25.12(A0)
A1: CAP3.18 EXTBUS.21 U25.13(A1)
A2: CAP3.19 EXTBUS.20
A3: CAP3.20 EXTBUS.19
A4: CAP3.21 EXTBUS.18
A5: CAP3.22 EXTBUS.17
A6: CAP3.23 EXTBUS.16
A7: CAP3.24 EXTBUS.15
A8: CAP3.25 EXTBUS.14
A9: CAP3.26 EXTBUS.13
A10: CAP3.27 EXTBUS.12
A11: CAP3.28 EXTBUS.11
A12: CAP3.29 EXTBUS.10
A13: CAP3.30 EXTBUS.9
A14: CAP3.31 EXTBUS.8
A15: CAP3.32 EXTBUS.7
A16: CAP3.33 EXTBUS.6 U28.77
A17: CAP3.34 EXTBUS.5 U28.76
A18: CAP3.35 EXTBUS.4 U28.75
A19: CAP3.36 EXTBUS.3 U28.74
ACT#: LED1.2 U6.24(ACT#)
AD1_BUSY: U1.14(BUSY) U28.49
AD1_OS0: R22.2 U1.3(OS0)
AD1_OS1: R20.2 U1.4(OS1)
AD1_OS2: R18.2 U1.5(OS2)
AD1_RANGE: R11.2 U1.8(RANGE)
AD1_REFCAP: C12.1 C13.1 U1.44(REFCAPA) U1.45(REFCAPB)
AD1_REFSEL: R14.2 U1.34(REFSEL)
AD1_SERPAR_SEL: R12.2 U1.6(SER/~{PAR}_SEL)
AD1_STBY: R16.2 U1.7(~{STBY})
AD2_BUSY: U2.14(BUSY) U28.35
AD2_OS0: R21.2 U2.3(OS0)
AD2_OS1: R19.2 U2.4(OS1)
AD2_OS2: R17.2 U2.5(OS2)
AD2_RANGE: R9.2 U2.8(RANGE)
AD2_REFCAP: C9.1 C10.1 U2.44(REFCAPA) U2.45(REFCAPB)
AD2_REFSEL: R13.2 U2.34(REFSEL)
AD2_SERPAR_SEL: R10.2 U2.6(SER/~{PAR}_SEL)
AD2_STBY: R15.2 U2.7(~{STBY})
AD-CON: U1.9(CONVSTA) U1.10(CONVSTB) U2.9(CONVSTA) U2.10(CONVSTB) U28.79
ADA0: CAP3.61 J1.1
ADA1: CAP3.62 J1.13
ADA2: CAP3.63 J1.2
ADA3: CAP3.64 J1.14
ADA4: CAP3.65 J1.3
ADA5: CAP3.66 J1.15
ADA6: CAP3.67 J1.4
ADA7: CAP3.68 J1.16
ADB0: CAP3.69 J1.5
ADB1: CAP3.70 J1.17
ADB2: CAP3.71 J1.6
ADB3: CAP3.72 J1.18
ADB4: CAP3.73 J1.7
ADB5: CAP3.74 J1.19
ADB6: CAP3.75 J1.8
ADB7: CAP3.76 J1.20
ADBUSY: P16.3 U28.66
ADCON: P17.3 U28.92
ADINA0: J5.26 U1.49(V1)
ADINA1: J5.25 U1.51(V2)
ADINA2: J5.24 U1.53(V3)
ADINA3: J5.23 U1.55(V4)
ADINA4: J5.22 U1.57(V5)
ADINA5: J5.21 U1.59(V6)
ADINA6: J5.20 U1.61(V7)
ADINA7: J5.19 U1.63(V8)
ADINB0: J6.26 U2.49(V1)
ADINB1: J6.25 U2.51(V2)
ADINB2: J6.24 U2.53(V3)
ADINB3: J6.23 U2.55(V4)
ADINB4: J6.22 U2.57(V5)
ADINB5: J6.21 U2.59(V6)
ADINB6: J6.20 U2.61(V7)
ADINB7: J6.19 U2.63(V8)
ADLO: J5.17 J5.18 J6.17 J6.18 R41.2
ADR421_VOUT: C1.1 C2.1 C5.1 C6.1 C7.1 C8.1 C11.1 C14.1 C117.1 C118.1 R178.2 R179.2 R180.2 R181.2 U1.42(REFIN/REFOUT) U2.42(REFIN/REFOUT) U5.6(VOUT) U25.1(VREFD) U25.2(VREFC) U25.3(VREFB) U25.4(VREFA)
ADRES: U1.11(RESET) U2.11(RESET) U28.52
AGND: CAP3.77 CAP3.78 J1.9 J1.10 J1.11 J1.12 J1.21 J1.22 J1.23 J1.24 J5.16 J6.16 R41.1
APWM1: J5.7 R7.1 U3.9(A7)
APWM2: J5.8 R8.1 U3.10(A8)
APWM3: J5.9 U4.9(A7)
APWM4: J6.7 U4.10(A8)
B: U12.110
C_TCK: P9.4 U28.67(TCK)
C_TDI: P9.7 U28.63(TDI)
C_TDO: P9.6 U28.122(TDO)
C_TMS: P9.9 U28.65(TMS)
CANH: CAN1.2 R26.2 U10.7(CANH)
CANI: CAN1.1 R26.1 U10.6(CANL)
CANRXB: U10.4(R)
CANTXB: U10.1(D)
CAP1: CAP3.93 U28.16
CAP2: CAP3.94 U28.15
CAP3: CAP3.95 U28.14
CAP4: CAP3.96 U28.13
CAP5: U28.95
CAP6: U28.61
CE0: EXTBUS.50 U28.107
CE1: EXTBUS.49 U28.106
CE2: EXTBUS.48 U28.105
CE3: EXTBUS.47 U28.104
D0: CAP3.1 EXTBUS.40 J2.2 U1.16(DB0) U2.16(DB0) U25.17(D0) U28.46
D1: CAP3.2 EXTBUS.39 J2.4 U1.17(DB1) U2.17(DB1) U25.18(D1) U28.45
D2: CAP3.3 EXTBUS.38 J2.6 U1.18(DB2) U2.18(DB2) U25.19(D2) U28.44
D3: CAP3.4 EXTBUS.37 J2.8 U1.19(DB3) U2.19(DB3) U25.20(D3) U28.43
D4: CAP3.5 EXTBUS.36 J2.10 U1.20(DB4) U2.20(DB4) U25.21(D4) U28.41
D5: CAP3.6 EXTBUS.35 J2.12 U1.21(DB5) U2.21(DB5) U25.22(D5) U28.40
D6: CAP3.7 EXTBUS.34 J2.14 U1.22(DB6) U2.22(DB6) U25.23(D6) U28.39
D7: CAP3.8 EXTBUS.33 J2.16 U1.24(DB7/DOUTA) U2.24(DB7/DOUTA) U25.24(D7) U28.38(IO/GCK3)
D8: CAP3.9 EXTBUS.32 J2.13 U1.25(DB8/DOUTB) U2.25(DB8/DOUTB) U25.25(D8)
D9: CAP3.10 EXTBUS.31 J2.15 U1.27(DB9) U2.27(DB9) U25.26(D9)
D10: CAP3.11 EXTBUS.30 J2.17 U1.28(DB10) U2.28(DB10) U25.27(D10)
D11: CAP3.12 EXTBUS.29 J2.19 U1.29(DB11) U2.29(DB11) U25.28(D11)
D12: CAP3.13 EXTBUS.28 J2.21 U1.30(DB12) U2.30(DB12)
D13: CAP3.14 EXTBUS.27 J2.23 U1.31(DB13) U2.31(DB13)
D14: CAP3.15 EXTBUS.26 J2.25 U1.32(DB14/HBEN) U2.32(DB14/HBEN)
D15: CAP3.16 EXTBUS.25 J2.27 U1.33(DB15/BYTESEL) U2.33(DB15/BYTESEL)
DAC0: R184.2 U25.5(VOUTA)
DAC1: R186.2 U25.6(VOUTB)
DAC2: R185.2 U25.7(VOUTC)
DAC3: R183.2 U25.8(VOUTD)
DSP_IO1/QEPA: CAP3.97 U28.10
DSP_IO2/QEPB: CAP3.98 U28.9
DSP_IO3/QEPS: CAP3.99 U28.7
DSP_IO4/QEPI: CAP3.100 U28.6(IO/GTS2)
DSP_IO/MCLKRA: CAP3.105 P19.2
DSP_IO/MCLKRB: CAP3.107 P21.2
DSP_IO/MFSRA: CAP3.106 P20.2
DSP_IO/MFSRB: CAP3.108 P22.2
DSPSOMI: CAP3.102 U13.4(1A2) U28.12
ELINK#: R46.1 U12.104(ELINK#)
EXCAP1-QEP: J7.2 U28.118
EXCAP2-QEP: J7.3 U28.117
EXCAP3-QEP: J7.4 U28.116
EXCAP4-QEP: J8.2 U28.143(IO/GSR)
EXCS0: CAP3.43 EXTBUS.54 U28.69
EXCS1: CAP3.42 EXTBUS.44 U28.70
EXINT1: P13.2
EXINT2: CAP3.49 P14.2
EXNMI: CAP3.47 P18.2
HOLD: P17.1
HOLDA: P16.1
IN1: J10.6 U28.91
IN2: J10.7 U28.88
IN3: J10.8 U28.87
IN4: J10.9 U28.86
IN5: J10.10 U28.85
LCD1CS: J2.29 U28.93
LCD-PWM: J2.37 U28.96
LCDRESET: J2.33 U28.80
MCLKRA: J10.13 P19.1
MCLKRB: J10.14 P21.1
MFSRA: J10.11 P20.1
MFSRB: J10.12 P22.1
NET-INT: U12.98(INT#) U28.56
NET/USBCS: P24.3 U28.11
NETCS: U12.114(SCS) U28.54
NETINT: P14.3 U28.68
NETSOMI: U12.117(SDO) U28.83
NMI: J10.18 P18.1
OPWM1: U3.21(B1) U28.125
OPWM2: U3.20(B2) U28.126
OPWM3: U3.19(B3) U28.128
OPWM4: U3.18(B4) U28.129
OPWM5: U3.17(B5) U28.130
OPWM6: U3.16(B6) U28.131
OPWM7: U4.21(B1) U28.136
OPWM8: U4.20(B2) U28.137
OPWM9: U4.19(B3) U28.138
OPWM10: U4.18(B4) U28.139
OPWM11: U4.17(B5) U28.140
OPWM12: U4.16(B6) U28.142
OUT1: J10.1 U28.102
OUT2: J10.2 U28.101
OUT3: J10.3 U28.100
OUT4: J10.4 U28.98
OUT5: J10.5 U28.97
PDPINTA*: CAP3.91 U28.19
PDPINTB*: CAP3.92 U28.17
PWM1: CAP3.79 U28.32(IO/GCK2)
PWM2: CAP3.80 U28.31
PWM3: CAP3.81 U28.30(IO/GCK1)
PWM4: CAP3.82 U28.28
PWM5: CAP3.83 U28.27
PWM6: CAP3.84 U28.26
PWM7: CAP3.85 U28.25
PWM8: CAP3.86 U28.24
PWM9: CAP3.87 U28.23
PWM10: CAP3.88 U28.22
PWM11: CAP3.89 U28.21
PWM12: CAP3.90 U28.20
R/W: CAP3.41 P23.2
RDY#: R47.1 U12.51(RDY#)
READY: EXTBUS.46 P15.1
RESET: CAP3.54
RST: U12.52(RST)
RSTI: C133.2 U12.63(RSTI)
RXD: U12.112(RXD)
RXIN: R33.1 U11.8(RDN) U12.11(RXIN)
RXIP: R34.1 U11.6(RDP) U12.10(RXIP)
SCAP1: U3.15(B7) U28.132
SCAP2: U3.14(B8) U28.133
SCAP3: U4.15(B7) U28.134
SCAP4: U4.14(B8) U28.135
SCI-485-ISO: P7.3 P8.2
SCI-485-R: P7.1 U8.1
SCI-485-T: P6.1 U8.4
SCI-485-T-ISO: P6.3 P8.1
SCI-485EN: P10.1 U8.2 U8.3
SCI-485EN-ISO: P8.3 P10.3
SCIRXDB: CAP3.109 U9.12(R1out)
SCIRXDC: CAP3.111 P2.2
SCIRXDC-232: P2.3 U9.9(R2out)
SCIRXDC-485: P2.1 P7.2
SCITXDB: CAP3.110 U9.11(T1in)
SCITXDC: CAP3.112 P1.2
SCITXDC-232: P1.3 U9.10(T2in)
SCITXDC-485: P1.1 P6.2
SCL: CAP3.114 R35.2 U13.21(2A4)
SDA: CAP3.113 R36.2 U13.22(2A5)
SEL: U12.53(SEL)
SPICLK: CAP3.103 U6.20(SCK/D5) U12.115(SCK) U13.7(1A3)
SPISIMO: CAP3.101 U6.21(SDI/D6) U12.116(SDI) U13.3(1A1)
SPISTE: P24.1 U13.8(1A4)
SPISTE/INT: CAP3.104 P24.2
T-CLK: J3.33 U28.115
T-CS: J3.31 U28.113
T-DIN: J3.29 U28.112
T-DO: J3.7 RL3.2 U28.94
TCLK: P19.3 U28.5(IO/GTS1)
TCS: P21.3 U28.3(IO/GTS4)
TDIN: P22.3 U28.2(IO/GTS3)
TDO: P20.3 U28.4
TIRQ: P18.3 U28.64
TXON: R42.1 U11.3(TDN) U12.15(TXON)
TXOP: R43.1 U11.1(TDP) U12.14(TXOP)
UD+: P3.3 U6.10(UD+)
UD-: P3.2 U6.11(UD-)
USB-INT: U6.1(INT#) U28.58
USBCS: U6.18(SCS/D3) U28.57
USBINT: P13.3 U28.51
USBSOMI: U6.22(SDO/D7) U28.82
VBAT: BAT1.1(VBATT) C53.1 CAP3.56
X_R/W: P23.1
XADS1: U1.13(~{CS}) U28.50
XADS2: U2.13(~{CS}) U28.48
XCLKOUT: CAP3.53 U28.60
XDAC0: J9.1 R90.1
XDAC1: J9.2 R111.1
XDAC2: J9.3 R110.1
XDAC3: J9.4 R89.1
XDACS0: U25.10(~{CS}) U28.78
XDSPSOMI: P5.2 U13.5(1B2)
XHOLD: CAP3.45 EXTBUS.51 P17.2
XHOLDA: EXTBUS.52 P16.2
XI: U6.13(XI) X2.1
XINT1: EXTBUS.61 J10.16 P13.1
XINT2: J10.15 P14.1
XO: U6.14(XO) X2.2
XPWM1: J5.1 R1.1 U3.3(A1)
XPWM2: J5.3 R2.1 U3.4(A2)
XPWM3: J5.5 R3.1 U3.5(A3)
XPWM4: J5.2 R4.1 U3.6(A4)
XPWM5: J5.4 R5.1 U3.7(A5)
XPWM6: J5.6 R6.1 U3.8(A6)
XPWM7: J6.1 U4.3(A1)
XPWM8: J6.2 U4.4(A2)
XPWM9: J6.3 U4.5(A3)
XPWM10: J6.4 U4.6(A4)
XPWM11: J6.5 U4.7(A5)
XPWM12: J6.6 U4.8(A6)
XQEPA: J5.11 U28.120
XQEPB: J5.12 U28.119
XQEPI: J5.14 U28.121
XQEPS: J5.13 U28.124
XRD*: CAP3.39 J2.11 U1.12(~{RD}/SCLK) U2.12(~{RD}/SCLK) U28.53
XREADY: P15.2
XRS*: CAP3.55 U28.59
XSCL: P5.5 P25.7 R38.2 U13.20(2B4)
XSDA: P5.6 P25.8 R37.2 U13.23(2B5)
XSPICLK: P5.3 U13.6(1B3)
XSPISIMO: P5.1 U13.2(1B1)
XSPISTE: P5.4 U13.9(1B4)
XWE*: CAP3.40 J2.9 U25.11(~{WR}) U28.71
XZLG_RESET: P25.10 U13.19(2B3)
ZLG-INT: P25.9 U28.103
ZLG_RESET: U13.18(2A3) U28.111
ZLGINT: P23.3 U28.33
NetB1_1: B1.1 U8.6
NetB2_1: B2.1 R23.2 R25.2 TVS2.1 U8.7
NetC15_1: C15.1 C17.1 U2.36(REGCAP)
NetC16_1: C16.1 C18.1 U2.39(REGCAP)
NetC19_1: C19.1 C21.1 U1.36(REGCAP)
NetC20_1: C20.1 C22.1 U1.39(REGCAP)
NetC43_1: C43.1 U9.2(V+)
NetC44_1: C44.1 U9.3(C1-)
NetC44_2: C44.2 U9.1(C1+)
NetC45_1: C45.1 U9.5(C2-)
NetC45_2: C45.2 U9.4(C2+)
NetC46_1: C46.1 R32.1 U9.6(V-)
NetC54_2: C54.2 C55.2 U15.1(GND)
NetC58_1: C58.1 P3.1 R27.1
NetC134_1: C134.1 R29.1 R30.1 R31.1
NetC137_2: C137.2 U12.20(XO) X1.2
NetC138_2: C138.2 U12.19(XI) X1.1
NetD1_2: D1.2 R1.2
NetD2_2: D2.2 R2.2
NetD3_2: D3.2 R3.2
NetD4_2: D4.2 R4.2
NetD5_2: D5.2 R5.2
NetD6_2: D6.2 R6.2
NetD7_2: D7.2 R7.2
NetD8_2: D8.2 R8.2
NetD9_2: D9.2 R39.1
NetD10_2: D10.2 R40.1
NetJ3_35: J3.35 RL1.2 RL2.1
NetJ4_2: J4.2(R) L3.1
NetJ11_2: J11.2(R) L4.1
NetL24.7uH_2: L24.7uH.2 U14.1(VIN)
NetLED1_1: LED1.1 R28.2
NetLED2_2: LED2.2 R45.2
NetLED3_2: LED3.2 R46.2
NetLED4_2: LED4.2 R47.2
NetP4_1: P4.1(TX+) U11.16(TXP)
NetP4_2: P4.2(TX-) U11.14(TXN)
NetP4_3: P4.3(RX+) U11.11(RXP)
NetP4_4: P4.4(NC) P4.5(NC) R30.2
NetP4_6: P4.6(RX-) U11.9(RXN)
NetP4_7: P4.7(NC) P4.8(NC) R29.2
NetP11_2: P11.2 R11.1
NetP12_2: P12.2 R9.1
NetR23_1: R23.1 R24.2 TVS1.1
NetR31_2: R31.2 U11.10(RX) U11.13(CTX) U11.15(TX)
NetR32_2: R32.2 RS232-1.4 U9.13(R1in)
NetR44_2: R44.2 U12.6(RESTE)
NetR89_2: R89.2 R174.1 U31.1
NetR90_2: R90.2 R175.1 U31B.1
NetR110_2: R110.2 R176.1 U33.1
NetR111_2: R111.2 R177.1 U33B.1
NetR127_1: R127.1 R174.2 R178.1 U31.3
NetR128_1: R128.1 R175.2 R179.1 U31B.3
NetR129_1: R129.1 R176.2 R180.1 U33.3
NetR130_1: R130.1 R177.2 R181.1 U33B.3
NetR183_1: R183.1 U31.2
NetR184_1: R184.1 U31B.2
NetR185_1: R185.1 U33.2
NetR186_1: R186.1 U33B.2
NetRS232-1_3: RS232-1.3 U9.14(T1out)
NetRS232-2_3: RS232-2.3 U9.7(T2out)
NetRS232-2_4: RS232-2.4 U9.8(R2in)

Not connected (* = marked no-connect by the designer): CAP3 44 46 48 50 52; J2 5 18 20 22 24 26 28 30 31 32 34 36 38 39 40; J3 2 4 5 6 8 10 12 13 14 15 16 17 18 19 20 21 22 23 24 25 26 27 28 30 32 34 36 38 40; J5 10 15; J6 8 9 10 11 12 13 14 15; J8 3 4; P9 3 5 8 10; RS232-1 2 5 6 7 8 9; RS232-2 2 5 6 7 8 9; U1 15(FRSTDATA); U2 15(FRSTDATA); U5 1(TP) 3(NIC) 5(TRIM) 7(NIC) 8(TP); U6 2(RSTI) 5(TXD) 6(RXD) 7(SD_DI) 8(A0) 15(D0) 16(D1) 17(D2) 19(BZ/D4) 23(SD_CS) 25(SD_DO) 26(SD_CK) 27(PCS#); U10 5(VREF); U12 99(A0) 100(PCS#) 106(RD#) 107(WR#) 118(D0) 119(D1) 120(D2) 121(D3) 123(D4) 124(D5) 125(D6) 126(D7); U13 10(1B5) 15(2B1) 16(2B2); U28 81

### Notes on the sheet
- Labels drawn without touching a wire or pin: -VCC, CANRXB, CANTXB, EXINT1, VCC, XHOLDA, XREADY
- (in symbol CAPACITOR POL) +
- (in symbol MAX485E) R; T
- (in symbol zuozi) JP1; JP2

### Library data of the parts
1 CAN1 = Header 2: Header, 2-Pin; LatestRevisionDate: 17-Jul-2002; LatestRevisionNote: Re-released for DXP Platform.; Publisher: Altium Limited
B1 B2 = BALL/S
C1 C3 C8 C9 C11 C12 C15 C16 C19 C20 C25 C26 C29-C31 C38-C41 C49 C50 C54 C56 C139 C140 = CAPACITOR POL: Capacitor
C2 C4-C7 C10 C13 C14 C17 C18 C21-C24 C27 C28 C32-C37 C42-C48 C51-C53 C55 C57 C58 C60-C62 C65-C75 C80-C85 C87-C96 C98-C110 C116 C117 C119-C138 C141 C142 = C
C63 C64 C76-C79 C86 C97 C111-C115 C118 = ELECTRO1: Electrolytic Capacitor
D1-D10 LED1-LED4 = LED
J1 = Header 24: Header, 24-Pin; LatestRevisionDate: 17-Jul-2002; LatestRevisionNote: Re-released for DXP Platform.; Publisher: Altium Limited
J2 J3 = MHDR2X20: Header, 20-Pin, Dual row; LatestRevisionDate: 17-Jul-2002; LatestRevisionNote: Re-released for DXP Platform.; Publisher: Altium Limited
J4 J11 = Phonejack3: Jack Socket, 1/4" [6.5mm], Thru-Hole, Vertical, 3-Conductor Open Circuit (Non-Normalling); PackageDocument: 2003; PCB_Layout: Complies with manufacturer's recommendation.; DrillAndSlotSize: Corresponds to nominal value.; Published: 15-Jul-2004; LatestRevisionDate: 15-Jul-2004; LatestRevisionNote: Component Replaced.; DatasheetDocument: 2003; PackageReference: S1VS_SSS; Publisher: Altium Limited; ComponentLink1Description: Manufacturer Link; ComponentLink1URL: http://www.cliffuk.co.uk/
J5 J6 = MHDR2X13: Header, 13-Pin, Dual row; LatestRevisionDate: 17-Jul-2002; LatestRevisionNote: Re-released for DXP Platform.; Publisher: Altium Limited
J7-J9 = Header 5H: Header, 5-Pin, Right Angle; LatestRevisionDate: 17-Jul-2002; LatestRevisionNote: Re-released for DXP Platform.; Publisher: Altium Limited
J10 = Header 10X2: Header, 10-Pin, Dual row; LatestRevisionDate: 17-Jul-2002; LatestRevisionNote: Re-released for DXP Platform.; Publisher: Altium Limited
P1 P2 P6-P8 P10-P24 = Header 3: Header, 3-Pin; LatestRevisionDate: 17-Jul-2002; LatestRevisionNote: Re-released for DXP Platform.; Publisher: Altium Limited
P3 = Pro7B.tmp_USB_24
P5 = Header 5X2: Header, 5-Pin, Dual row; LatestRevisionDate: 17-Jul-2002; LatestRevisionNote: Re-released for DXP Platform.; Publisher: Altium Limited
P9 P25 = Header 10: Header, 10-Pin; LatestRevisionDate: 17-Jul-2002; LatestRevisionNote: Re-released for DXP Platform.; Publisher: Altium Limited
R1-R8 R23-R47 R89 R90 R110 R111 R127-R130 R174-R181 R183-R186 RL1-RL3 = DZ
R9-R22 = RES2
TVS1 TVS2 = BITVS
U1 U2 = AD7606
U3 U4 = 74LVC4245A
U6 = CH376S: USB Host and SD card Host with File System & USB Device for MCU, parallel / SPI / UART Serial
U7 = LM1117_3.3V
U8 = MAX485E
U9 = MAX232
U10 = SN65HVD230
U13 = SN74CBT3384ADBLE: 10-Bit FET Bus Switch; ComponentAvailability: Obsolete; Published: 8-Jun-2000; LatestRevisionDate: 16-Oct-2006; LatestRevisionNote: IPC-7351 Footprint Added.; DatasheetVersion: May-1998; PackageVersion: May-1999; PackageReference: DB024; Publisher: Altium Limited; PackageDescription: 24-Pin Plastic Small Outline Package 0.65 mm Pitch; Code_JEDEC: MO-150-AG; Code_IPC: SOP65P780-24; ComponentLink1Description: Manufacturer Link; ComponentLink1URL: http://www.ti.com/; ComponentLink2Description: Datasheet; ComponentLink2URL: http://www-s.ti.com/sc/ds/sn74cbt3384a.pdf
U14 = NMA0515S: Isolated 1W Dual Output; Note: Pins 3 and 7 are not present.; Published: 8-Jun-2000; LatestRevisionDate: 17-Jul-2002; LatestRevisionNote: Re-released for DXP Platform.; DatasheetVersion: Jul-1996; PackageVersion: 1996; PackageReference: NPSIP7; Publisher: Altium Limited; PackageDescription: SIP; 7 Leads (2 Absent); Body 19.5 x 6 mm (LxW typ); Pitch 2.54 mm; ComponentLink1Description: Manufacturer Link; ComponentLink1URL: http://www.dc-dc.com/; ComponentLink2Description: Datasheet; ComponentLink2URL: http://www.cd4power.com/data/power/ncl/ndc_nma_3.pdf
U15 = LM1085IS-3.3: 3A Low Dropout Positive Regulators; Manufacturer: National Semiconductor; CompType: LDO IC; PackageTopMarking: NSUZXYTTE#*LM1085*IS-3.3; PowerWise: N; Published: 4-Dec-2008; DatasheetVersion: Jun-2005; PackageVersion: revF, Apr-2005; PackageReference: TS3B; Publisher: Altium Limited; PackageDescription: TO-263, Molded, .400 x .390 x .180in, 3 Lead, .1in Pitch, Surface Mount; PartNumber: LM1085IS-3.3; RoHS: O; PinCount: 3; DigiKeyPartNumber: LM1085IS-3.3-ND; Code_JEDEC: MO-169-AA; ComponentLink1Description: LM1085 Datasheet; ComponentLink1URL: http://www.national.com/ds/LM/LM1085.pdf; ComponentLink2Description: LM1085 Web Page; ComponentLink2URL: http://www.national.com/pf/LM/LM1085.html; ComponentLink3Description: TS3B Package Page; ComponentLink3URL: http://www.national.com/packaging/folders/ts3b.html
U25 = AD5344
U28 = XC95288_TQ144
U31 U31B U33 U33B = LF412
X1 X2 = Pro7B.tmp_12MHz_19
U5 = ADR421ARZ: BodyName: *; Instance: *; PartName: *; PLACEMENT_REGION: *; CompValue: *; Right: *; Bottom: *; SymName: *; RefLocation: *; BoardLocation: *; SlotXofY: *